# EAGLE board xio2 (EAGLE 9.2.2), part 1 of 5
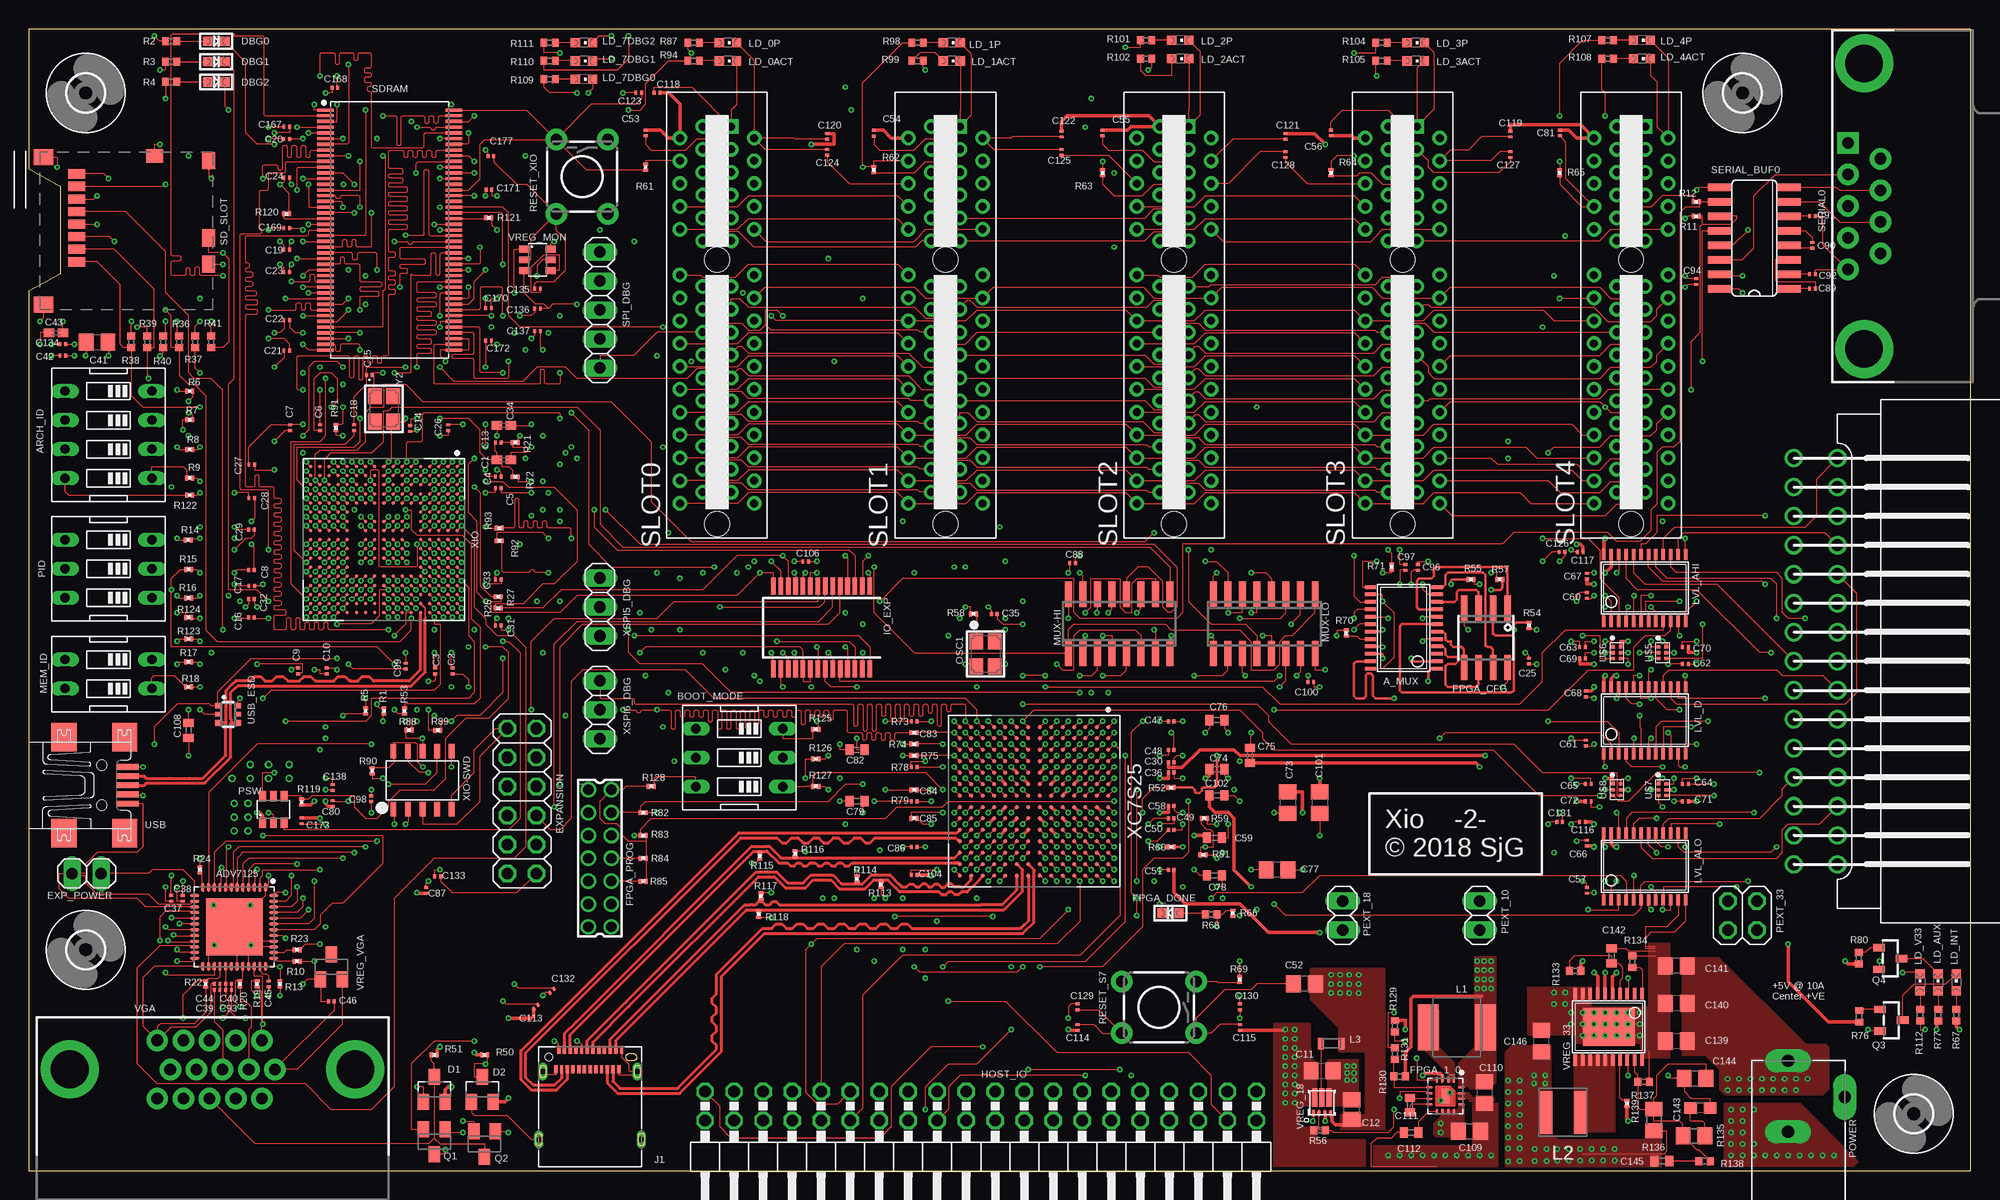
[diagram p19: board, top side]
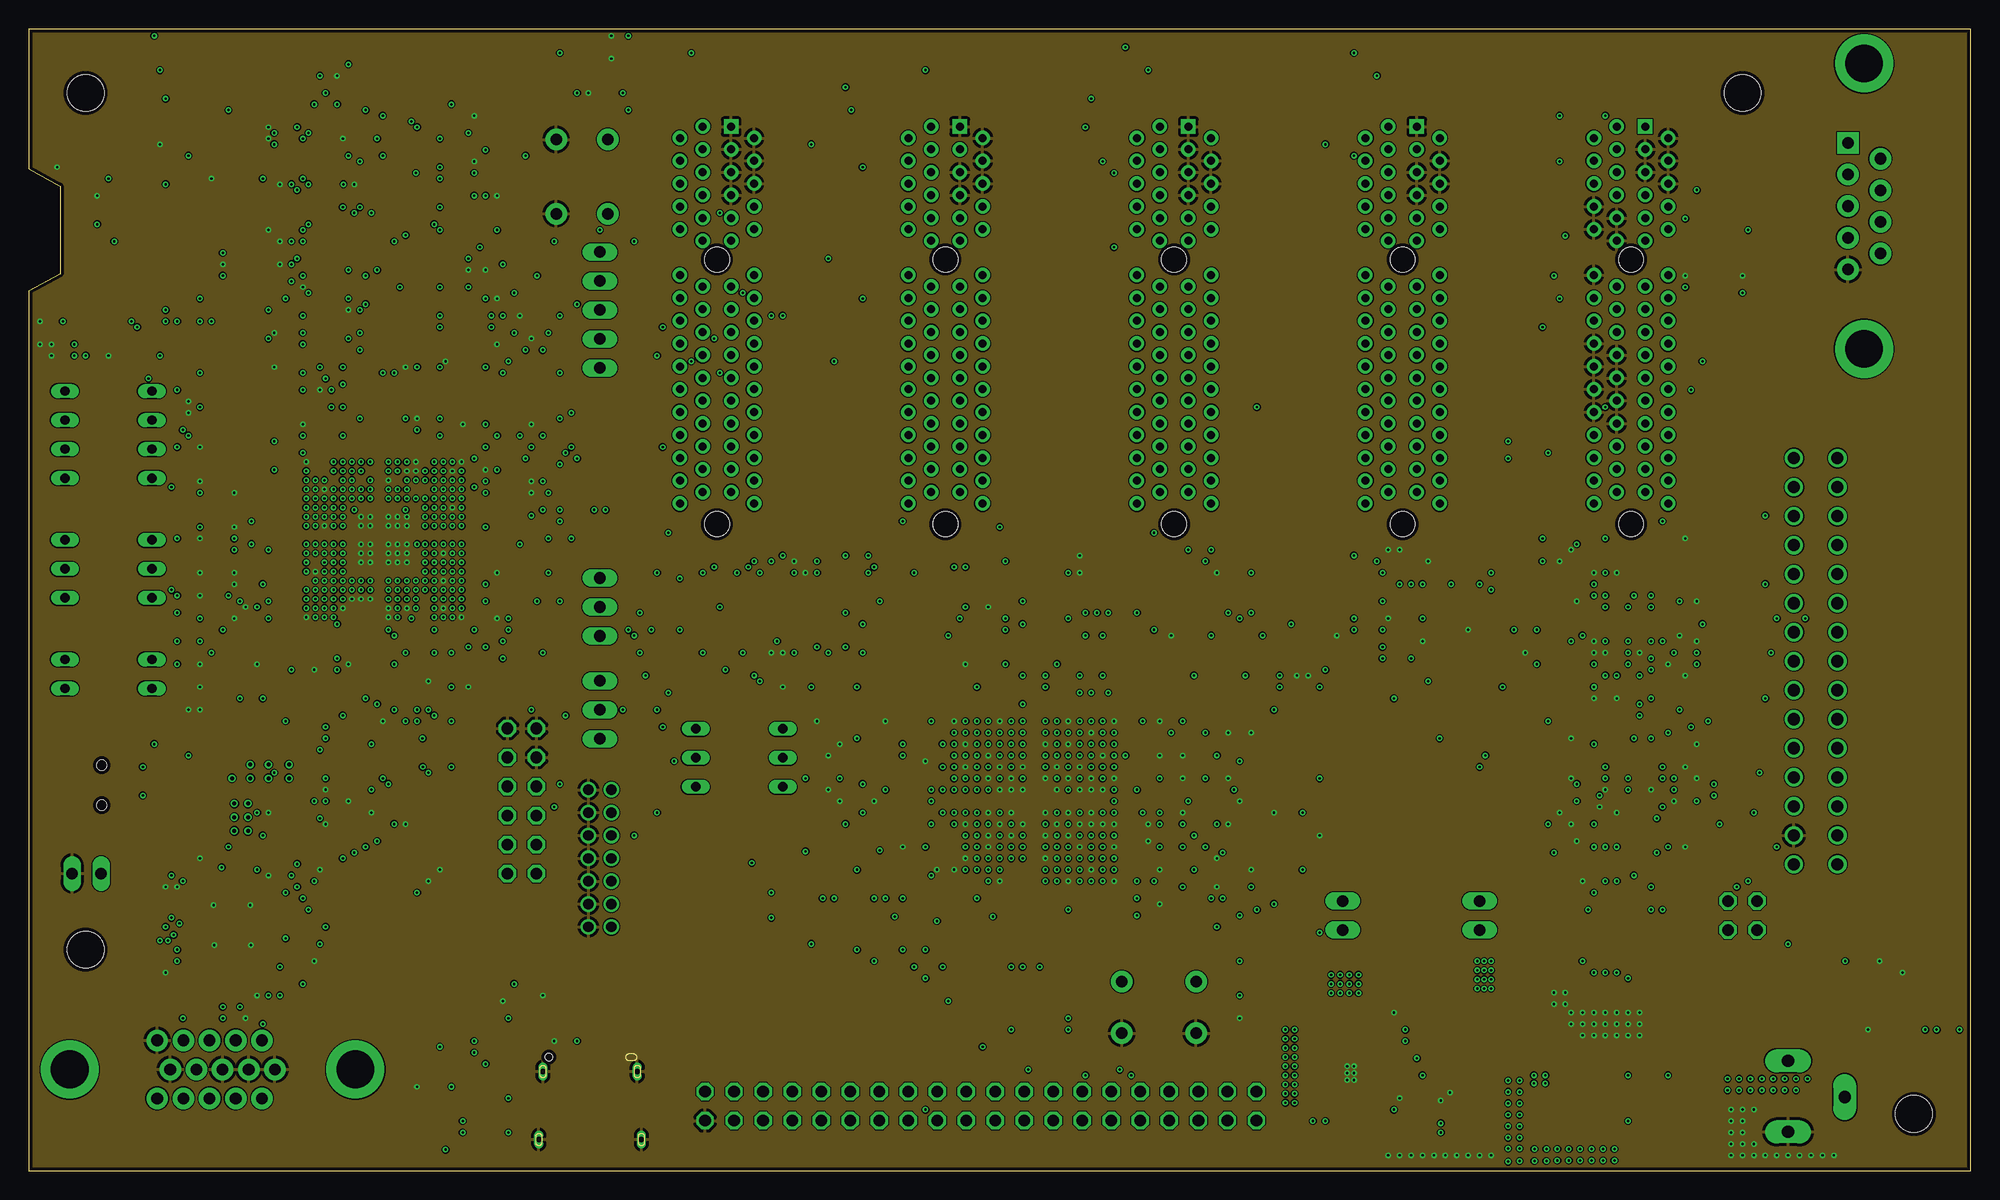
[diagram p20: board, inner layer Route2]
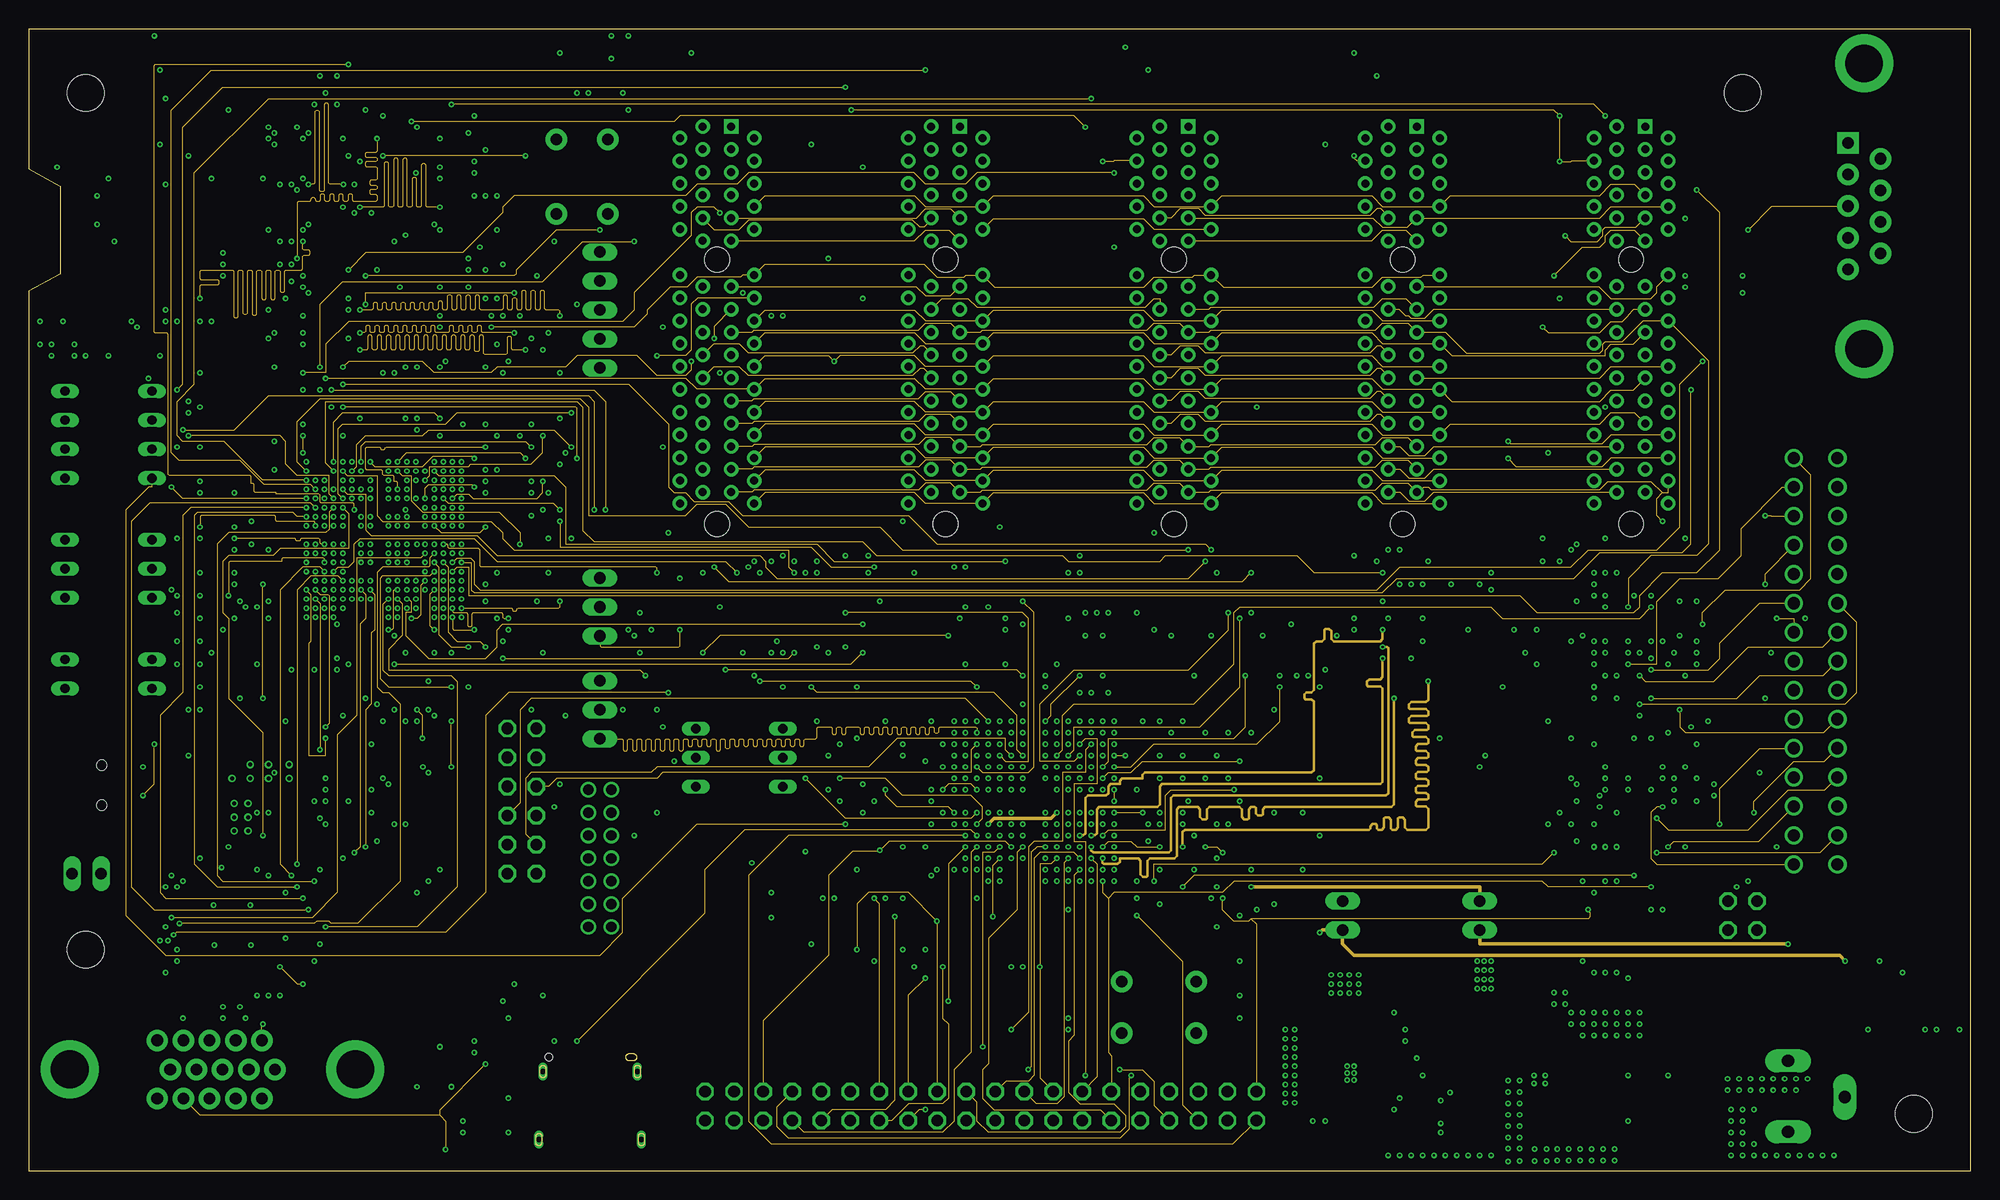
[diagram p21: board, inner layer Route3]
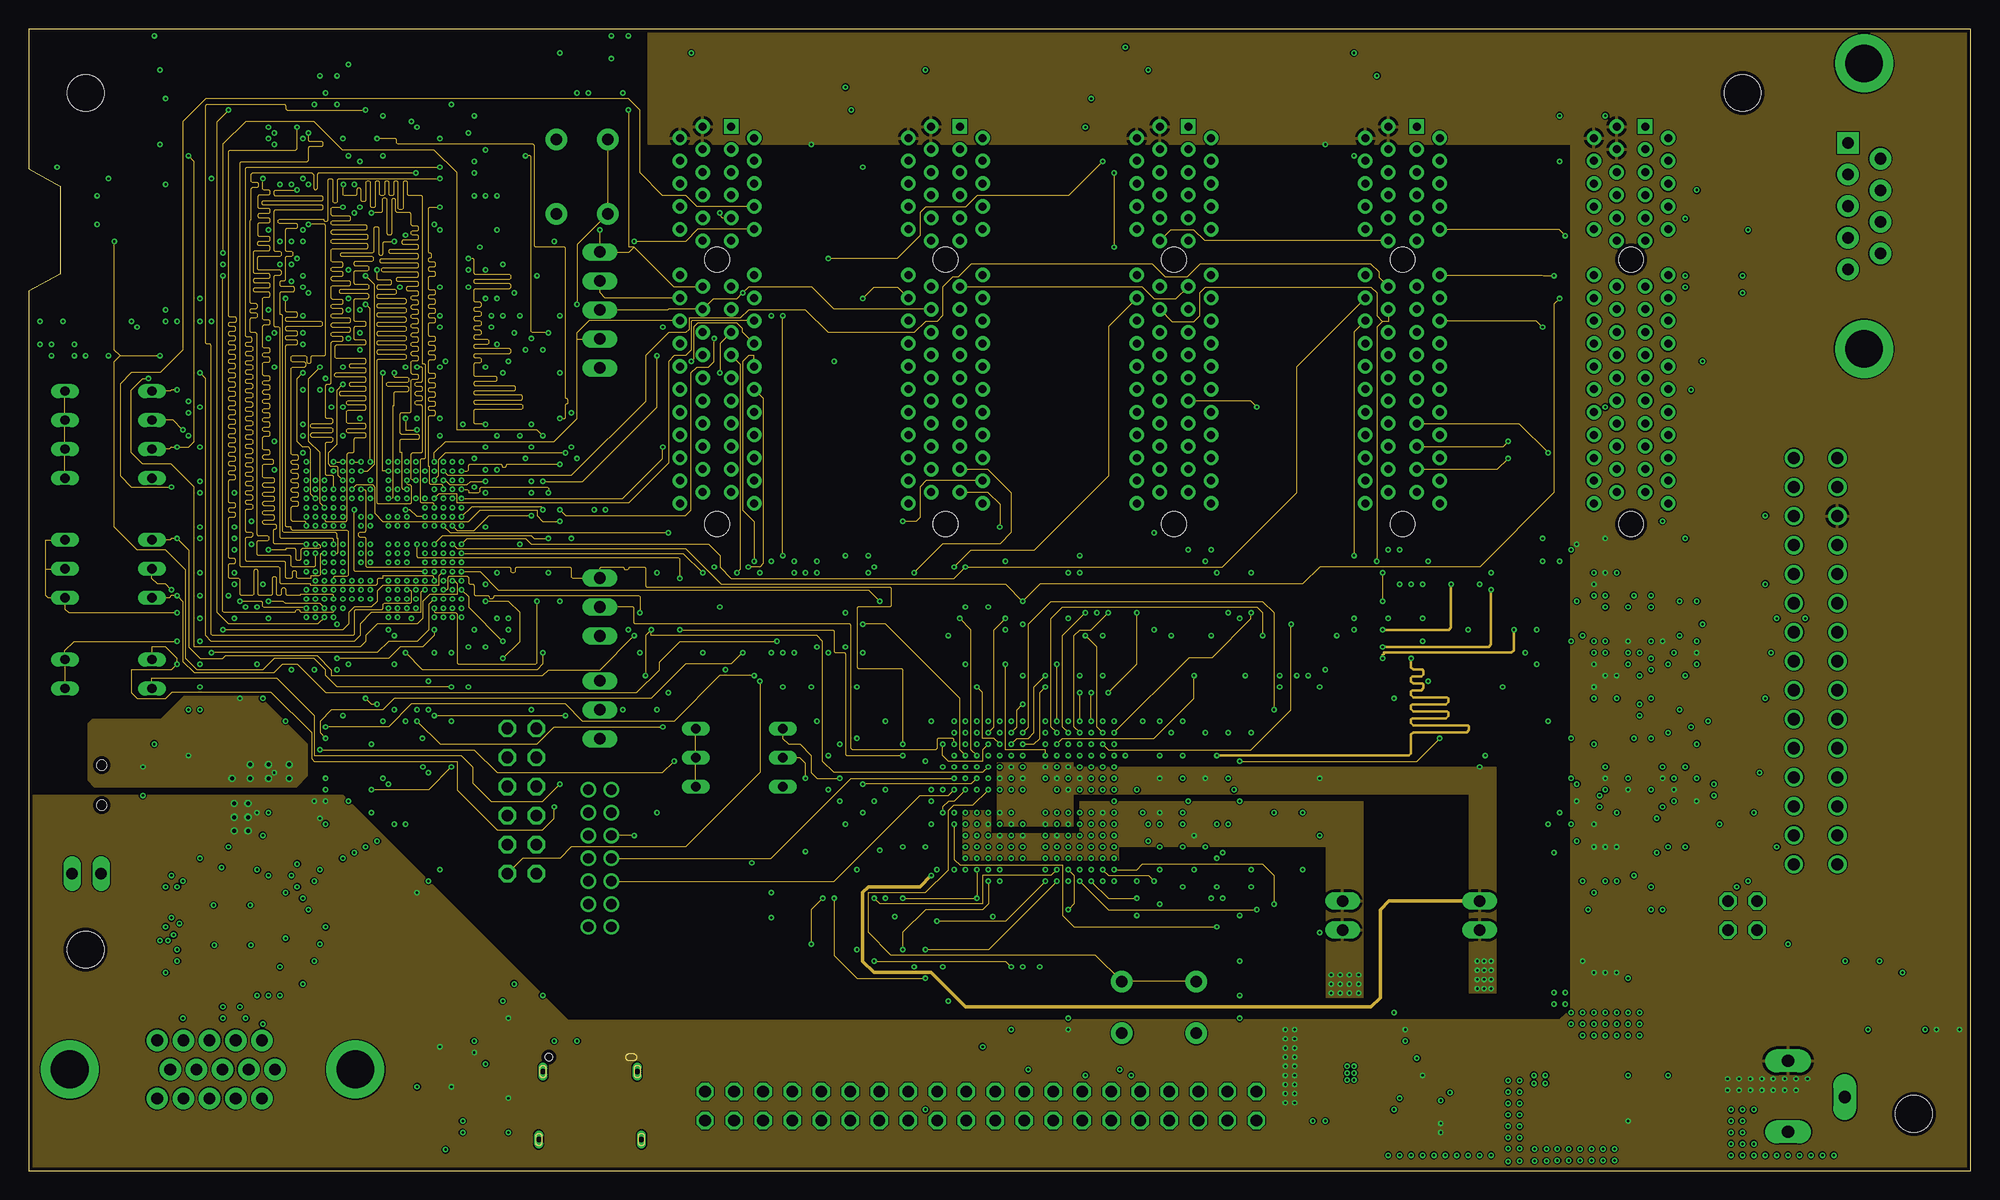
[diagram p22: board, inner layer Route14]
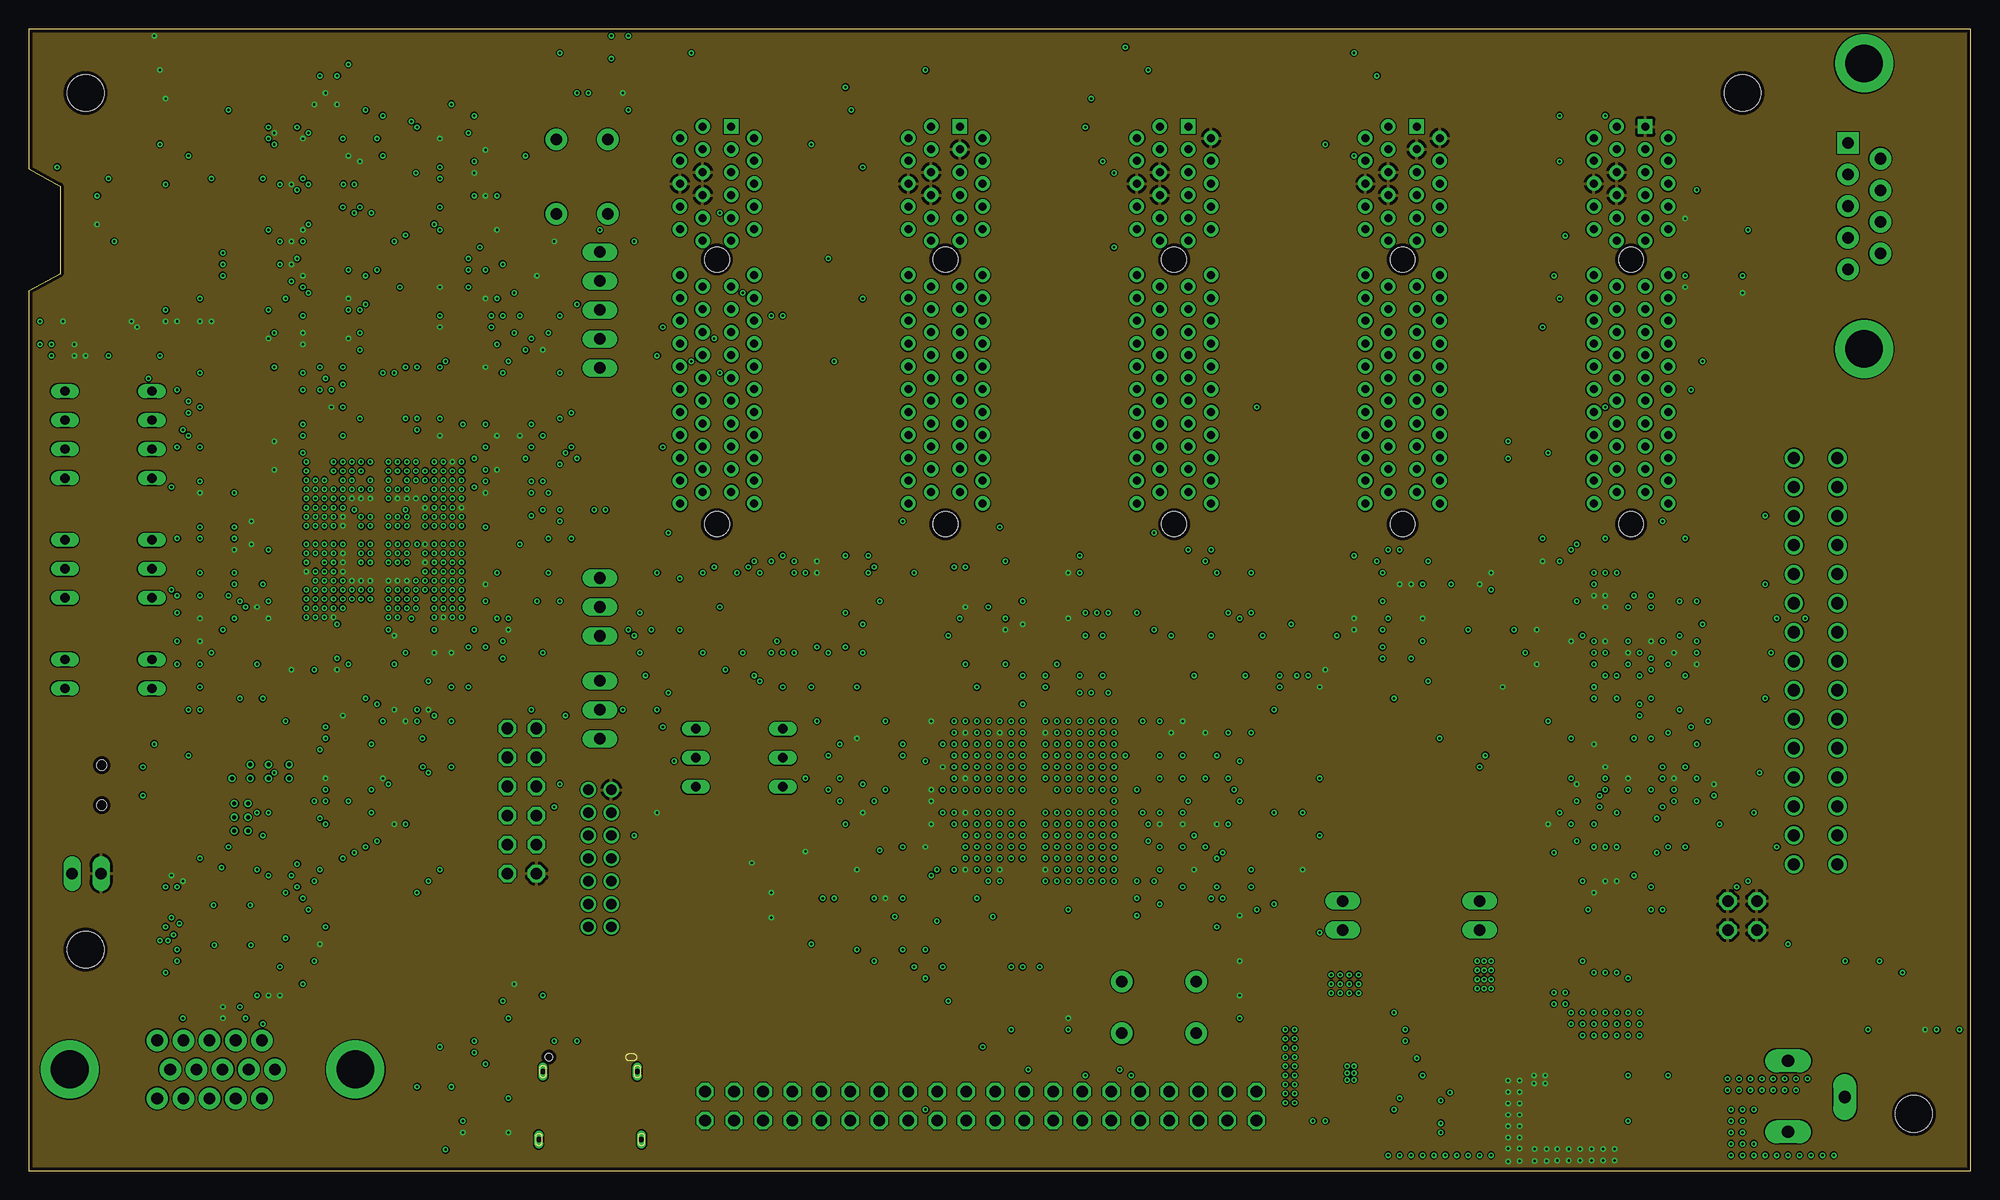
[diagram p23: board, inner layer Route15]
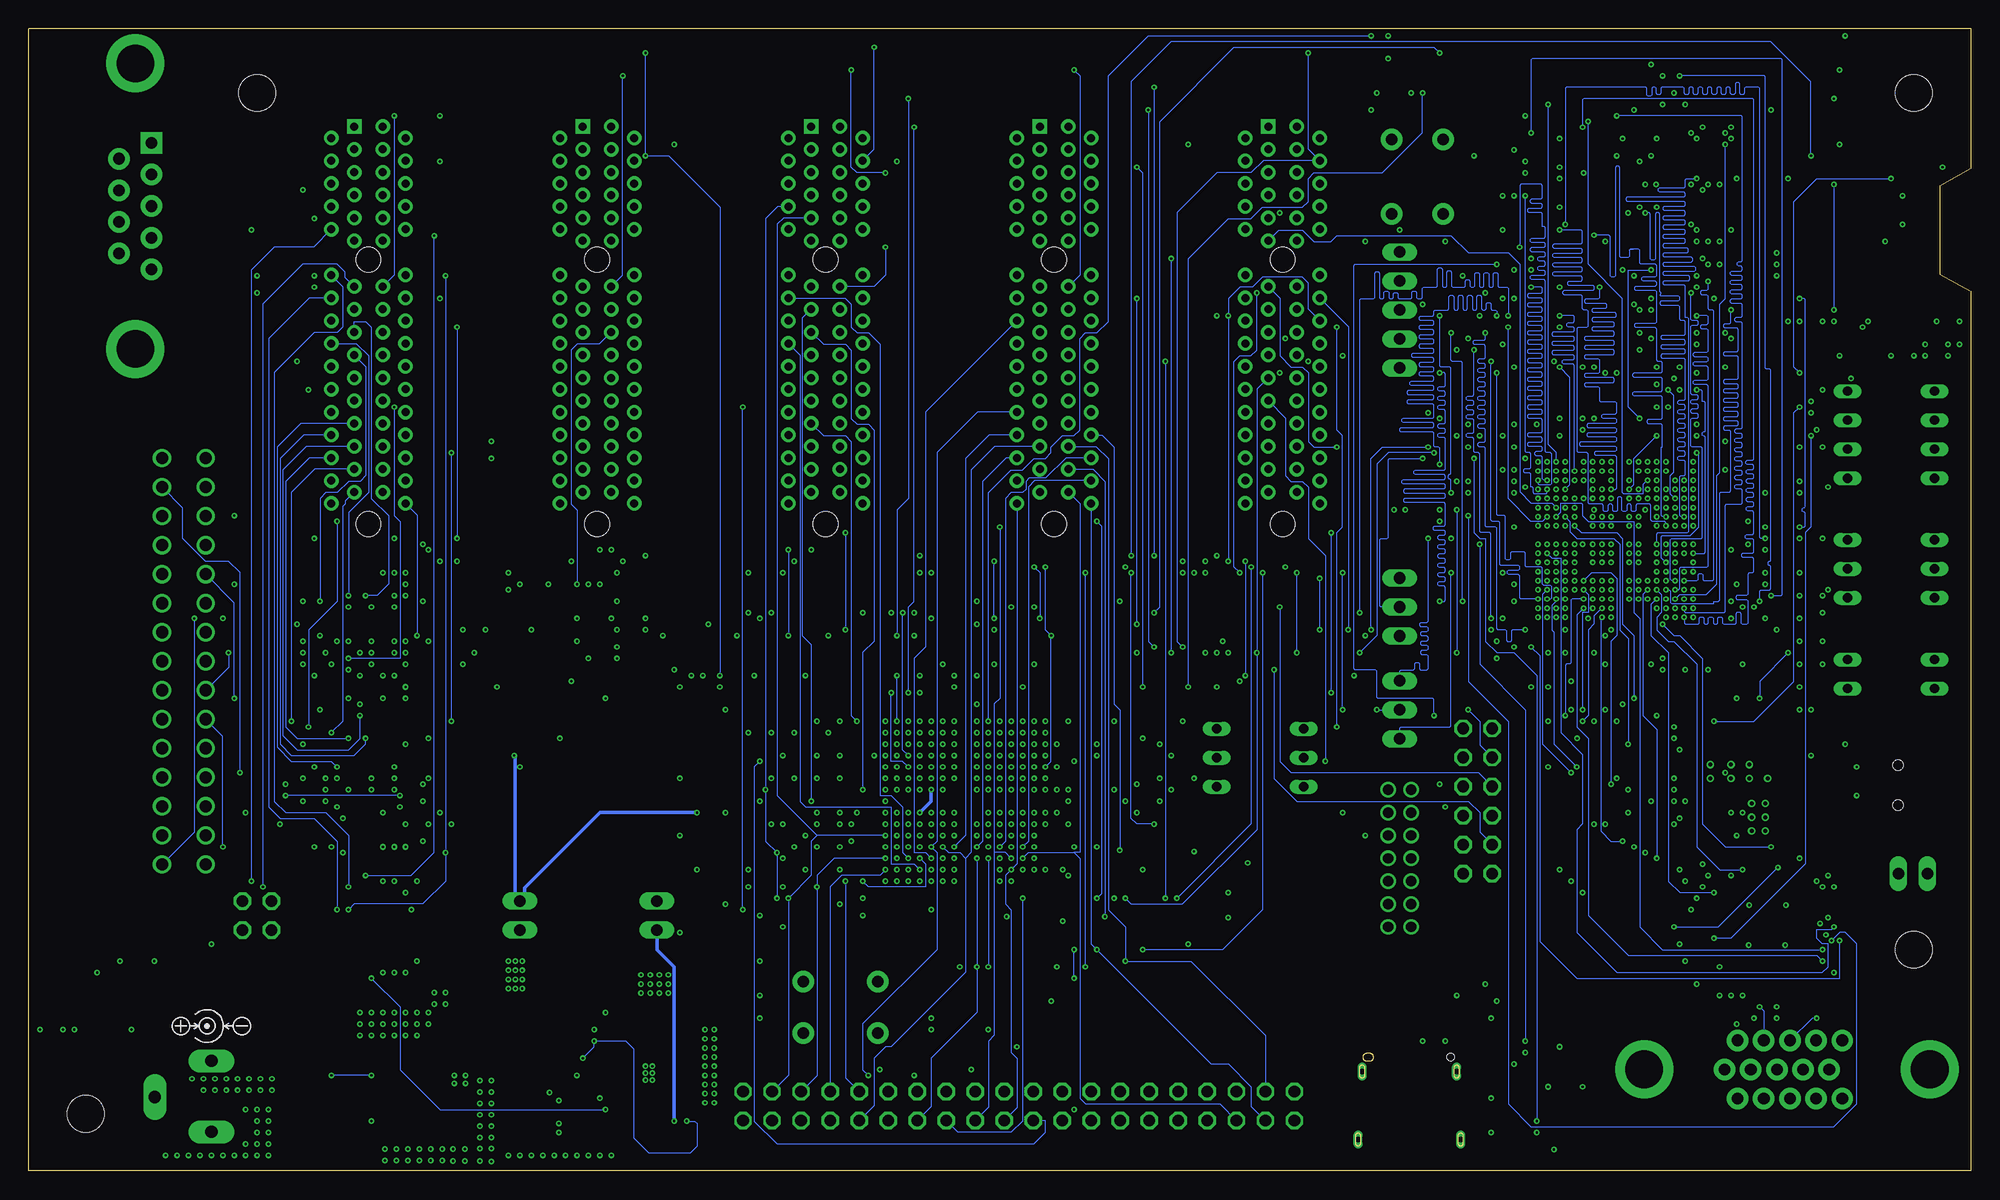
[diagram p24: board, bottom side, seen from below]

Size 170 x 100 mm. Coordinates in mm from the lower left corner, seen from the top.
Outline: 170,0 170,100 23.5,100 23,100 15,100 14,100 13,100 0,100 0,87.71 2.75,86.21 2.75,78.52 0,77.02 0,0 123.89,0 153.03,0 170,0
Copper layers (1+2*3+14*15+16): Top 0.035mm / dielectric 0.12mm / Route2 0.017mm / dielectric 0.5mm / Route3 0.017mm / dielectric 0.24mm / Route14 0.017mm / dielectric 0.5mm / Route15 0.017mm / dielectric 0.12mm / Bottom 0.035mm
Design rules "seed-6layer-4.4": minimum track width 4mil, minimum drill 0.2mm, track to track 4mil, track to pad 4mil, pad to pad 4mil, via to via 4mil, smd to smd 0mil, copper to edge 12mil, drill to drill 12mil, minimum pad ring 6mil, minimum via ring 5.5mil, stop-mask expansion 4mil, vias tented up to drill 25mil, thermal gap 10mil
Net classes: 1 Power: width 0.305 mm, drill 0.203 mm; 2 Slot-power: width 0.508 mm; 3 tx100: width 0.254 mm, clearance 0.457 mm; 4 usb90: width 0.254 mm, clearance 0.178 mm; 5 cclk50: width 0.203 mm; 6 3v3: width 0.254 mm; 7 vccint_aux: width 0.305 mm; 14 qspi: width 0.203 mm

## Footprints (pad centres in the part's own frame; a part is rotated, then mirrored left to right if it is on the bottom)
TSSOP24 = smd 0.305 x 0.991: 1 -3.575,-2.918; 2 -2.925,-2.918; 3 -2.275,-2.918; 4 -1.625,-2.918; 5 -0.975,-2.918; 6 -0.325,-2.918; 7 0.325,-2.918; 8 0.975,-2.918; 9 1.625,-2.918; 10 2.275,-2.918; 11 2.925,-2.918; 12 3.575,-2.918; 13 3.575,2.918; 14 2.925,2.918; 15 2.275,2.918; 16 1.625,2.918; 17 0.975,2.918; 18 0.325,2.918; 19 -0.325,2.918; 20 -0.975,2.918; 21 -1.625,2.918; 22 -2.275,2.918; 23 -2.925,2.918; 24 -3.575,2.918
QFN50P700X700X100-49T495 = smd 0.812 x 0.262: 1 -3.45,2.75; 2 -3.45,2.25; 3 -3.45,1.75; 4 -3.45,1.25; 5 -3.45,0.75; 6 -3.45,0.25; 7 -3.45,-0.25; 8 -3.45,-0.75; 9 -3.45,-1.25; 10 -3.45,-1.75; 11 -3.45,-2.25; 12 -3.45,-2.75; 25 3.45,-2.75; 26 3.45,-2.25; 27 3.45,-1.75; 28 3.45,-1.25; 29 3.45,-0.75; 30 3.45,-0.25; 31 3.45,0.25; 32 3.45,0.75; 33 3.45,1.25; 34 3.45,1.75; 35 3.45,2.25; 36 3.45,2.75 | smd 0.262 x 0.812: 13 -2.75,-3.45; 14 -2.25,-3.45; 15 -1.75,-3.45; 16 -1.25,-3.45; 17 -0.75,-3.45; 18 -0.25,-3.45; 19 0.25,-3.45; 20 0.75,-3.45; 21 1.25,-3.45; 22 1.75,-3.45; 23 2.25,-3.45; 24 2.75,-3.45; 37 2.75,3.45; 38 2.25,3.45; 39 1.75,3.45; 40 1.25,3.45; 41 0.75,3.45; 42 0.25,3.45; 43 -0.25,3.45; 44 -0.75,3.45; 45 -1.25,3.45; 46 -1.75,3.45; 47 -2.25,3.45; 48 -2.75,3.45 | smd 4.95 x 4.95: 49 0,0
EDG-04 = drill 0.813 long: 1 -3.81,-3.81; 2 -1.27,-3.81; 3 1.27,-3.81; 4 3.81,-3.81; 5 3.81,3.81; 6 1.27,3.81; 7 -1.27,3.81; 8 -3.81,3.81
EDG-03 = drill 0.813 long: 1 -2.54,-3.81; 2 0,-3.81; 3 2.54,-3.81; 4 2.54,3.81; 5 0,3.81; 6 -2.54,3.81
C0402K = smd 0.925 x 0.74: 1 -0.6,0; 2 0.6,0
C0201 = smd 0.25 x 0.35: 1 -0.25,0; 2 0.25,0
C0805 = smd 1.3 x 1.5: 1 -0.95,0; 2 0.95,0
C2012 = smd 1.3 x 1.5: 1 -0.85,0; 2 0.85,0
C0402 = smd 0.7 x 0.9: 1 -0.65,0; 2 0.65,0
C0603 = smd 1.1 x 1: 1 -0.85,0; 2 0.85,0
A8_CART = drill 1.067: P1 -17.78,6.35; P2 -15.24,6.35; P3 -12.7,6.35; P4 -10.16,6.35; P5 -7.62,6.35; P6 -5.08,6.35; P7 -2.54,6.35; P8 0,6.35; P9 2.54,6.35; P10 5.08,6.35; P11 7.62,6.35; P12 10.16,6.35; P13 12.7,6.35; P14 15.24,6.35; P15 17.78,6.35; PA -17.78,10.16; PB -15.24,10.16; PC -12.7,10.16; PD -10.16,10.16; PE -7.62,10.16; PF -5.08,10.16; PH -2.54,10.16; PJ 0,10.16; PK 2.54,10.16; PL 5.08,10.16; PM 7.62,10.16; PN 10.16,10.16; PP 12.7,10.16; PR 15.24,10.16; PS 17.78,10.16
SOT23 = smd 1 x 1.4: 1 -0.95,-1.1; 2 0.95,-1.1; 3 0,1.1
CHIPLED_0603 = smd 0.8 x 0.8: A 0,-0.75; C 0,0.75
1X02 = drill 1.016 long: 1 -1.27,0; 2 1.27,0
2X06 = drill 1.016 octagon: 1 -6.35,-1.27; 2 -6.35,1.27; 3 -3.81,-1.27; 4 -3.81,1.27; 5 -1.27,-1.27; 6 -1.27,1.27; 7 1.27,-1.27; 8 1.27,1.27; 9 3.81,-1.27; 10 3.81,1.27; 11 6.35,-1.27; 12 6.35,1.27
QFN50P310X310X100-16 = smd 0.6 x 0.24: 1 -1.4,0.75; 2 -1.4,0.25; 3 -1.4,-0.25; 4 -1.4,-0.75; 9 1.4,-0.75; 10 1.4,-0.25; 11 1.4,0.25; 12 1.4,0.75 | smd 0.24 x 0.6: 5 -0.75,-1.4; 6 -0.25,-1.4; 7 0.25,-1.4; 8 0.75,-1.4; 13 0.75,1.4; 14 0.25,1.4; 15 -0.25,1.4; 16 -0.75,1.4 | smd 1.27 x 0.635: PAD 0,0
SOIC8_150MIL = smd 0.6 x 2.2: 1 -1.905,-2.6; 2 -0.635,-2.6; 3 0.635,-2.6; 4 1.905,-2.6; 5 1.905,2.6; 6 0.635,2.6; 7 -0.635,2.6; 8 -1.905,2.6
332-14 = drill 0.9 pad 1.27: 1 -6,-1; 2 -6,1; 3 -4,-1; 4 -4,1; 5 -2,-1; 6 -2,1; 7 0,-1; 8 0,1; 9 2,-1; 10 2,1; 11 4,-1; 12 4,1; 13 6,-1; 14 6,1
3,2 = hole 3.2: 0,0
2X20/90 = drill 1.016 octagon: 1 -24.13,-6.35; 2 -24.13,-3.81; 3 -21.59,-6.35; 4 -21.59,-3.81; 5 -19.05,-6.35; 6 -19.05,-3.81; 7 -16.51,-6.35; 8 -16.51,-3.81; 9 -13.97,-6.35; 10 -13.97,-3.81; 11 -11.43,-6.35; 12 -11.43,-3.81; 13 -8.89,-6.35; 14 -8.89,-3.81; 15 -6.35,-6.35; 16 -6.35,-3.81; 17 -3.81,-6.35; 18 -3.81,-3.81; 19 -1.27,-6.35; 20 -1.27,-3.81; 21 1.27,-6.35; 22 1.27,-3.81; 23 3.81,-6.35; 24 3.81,-3.81; 25 6.35,-6.35; 26 6.35,-3.81; 27 8.89,-6.35; 28 8.89,-3.81; 29 11.43,-6.35; 30 11.43,-3.81; 31 13.97,-6.35; 32 13.97,-3.81; 33 16.51,-6.35; 34 16.51,-3.81; 35 19.05,-6.35; 36 19.05,-3.81; 37 21.59,-6.35; 38 21.59,-3.81; 39 24.13,-6.35; 40 24.13,-3.81
SSOP28 = smd 0.4 x 1.5: 1 -4.225,-3.625; 2 -3.575,-3.625; 3 -2.925,-3.625; 4 -2.275,-3.625; 5 -1.625,-3.625; 6 -0.975,-3.625; 7 -0.325,-3.625; 8 0.325,-3.625; 9 0.975,-3.625; 10 1.625,-3.625; 11 2.275,-3.625; 12 2.925,-3.625; 13 3.575,-3.625; 14 4.225,-3.625; 15 4.225,3.625; 16 3.575,3.625; 17 2.925,3.625; 18 2.275,3.625; 19 1.625,3.625; 20 0.975,3.625; 21 0.325,3.625; 22 -0.325,3.625; 23 -0.975,3.625; 24 -1.625,3.625; 25 -2.275,3.625; 26 -2.925,3.625; 27 -3.575,3.625; 28 -4.225,3.625
AMPHENOL_12401598E4#2A = smd 0.3 x 0.7: A1 -2.75,0.66; A2 -2.25,0.66; A3 -1.75,0.66; A4 -1.25,0.66; A5 -0.75,0.66; A6 -0.25,0.66; A7 0.25,0.66; A8 0.75,0.66; A9 1.25,0.66; A10 1.75,0.66; A11 2.25,0.66; A12 2.75,0.66; B1 2.5,-1.04; B2 2,-1.04; B3 1.5,-1.04; B4 1,-1.04; B5 0.5,-1.04; B6 0,-1.04; B7 -0.5,-1.04; B8 -1,-1.04; B9 -1.5,-1.04; B10 -2,-1.04; B11 -2.5,-1.04; B12 -3,-1.04 | drill 0.5 pad 0.8 long: SH1 -4.13,-1.25; SH2 -4.49,-7.2; SH3 4.49,-7.2; SH4 4.13,-1.25 | hole 0.65: -3.6,0
L5650M = smd 1.8 x 4: 1 -2.5,0; 2 2.5,0
RESC4137X200 = smd 1.1 x 3.7: 1 -1.5,0; 2 1.5,0
L0603 = smd 0.55 x 1: 1 -0.9,0; 2 0.9,0
EDG-02 = drill 0.813 long: 1 -1.27,-3.81; 2 1.27,-3.81; 3 1.27,3.81; 4 -1.27,3.81
SO16 = smd 0.6 x 2.2: 1 -4.445,-2.6; 2 -3.175,-2.6; 3 -1.905,-2.6; 4 -0.635,-2.6; 5 0.635,-2.6; 6 1.905,-2.6; 7 3.175,-2.6; 8 4.445,-2.6; 9 4.445,2.6; 10 3.175,2.6; 11 1.905,2.6; 12 0.635,2.6; 13 -0.635,2.6; 14 -1.905,2.6; 15 -3.175,2.6; 16 -4.445,2.6
OSC_3.2X2.5MM = smd 1.4 x 1.2: 1 -1.1,-0.8; 2 1.1,-0.8; 3 1.1,0.8; 4 -1.1,0.8
2X02 = drill 1.016 octagon: 1 -1.27,-1.27; 2 -1.27,1.27; 3 1.27,-1.27; 4 1.27,1.27
DCJ3P-14.2X11.0X9.0MM = drill 1.067 pad 2.032 long: + 3.175,0; -1 -3.048,0; -2 0,-4.953
SOT23-6 = smd 0.6 x 0.9: 1 -0.95,-1.15; 2 0,-1.15; 3 0.95,-1.15; 4 0.95,1.15; 5 0,1.15; 6 -0.95,1.15
SOT23-R = smd 0.635 x 1.016: 1 -0.95,-1; 2 0.95,-1; 3 0,1
R0201 = smd 0.28 x 0.43: 1 -0.255,0; 2 0.255,0
R0402 = smd 0.6 x 0.7: 1 -0.5,0; 2 0.5,0
R0805 = smd 1.3 x 1.5: 1 -0.95,0; 2 0.95,0
TACTILE-PTH = drill 1.016 pad 1.88: 1 -3.251,2.261; 2 3.251,2.261; 3 -3.251,-2.261; 4 3.251,-2.261
5025700893 = smd 1.5 x 1.15: DTCT -0.6,-7.375; GND1 6.15,-7.375; GND3 -2.9,-7.375 | smd 1.4 x 1.7: GND0 6.45,7.1; GND2 -6.45,7.1 | smd 1.15 x 1.5: GND4 6.575,-2.65 | smd 0.8 x 1.5: P$1 -2.7,4.2; P$2 -1.6,4.2; P$3 -0.5,4.2; P$4 0.6,4.2; P$5 1.7,4.2; P$6 2.8,4.2; P$7 3.9,4.2; P$8 5,4.2
SOP50P1176X120-86 = smd 1.436 x 0.28: 1 -5.619,10.5; 2 -5.619,10; 3 -5.619,9.5; 4 -5.619,9; 5 -5.619,8.5; 6 -5.619,8; 7 -5.619,7.5; 8 -5.619,7; 9 -5.619,6.5; 10 -5.619,6; 11 -5.619,5.5; 12 -5.619,5; 13 -5.619,4.5; 14 -5.619,4; 15 -5.619,3.5; 16 -5.619,3; 17 -5.619,2.5; 18 -5.619,2; 19 -5.619,1.5; 20 -5.619,1; 21 -5.619,0.5; 22 -5.619,0; 23 -5.619,-0.5; 24 -5.619,-1; 25 -5.619,-1.5; 26 -5.619,-2; 27 -5.619,-2.5; 28 -5.619,-3; 29 -5.619,-3.5; 30 -5.619,-4; 31 -5.619,-4.5; 32 -5.619,-5; 33 -5.619,-5.5; 34 -5.619,-6; 35 -5.619,-6.5; 36 -5.619,-7; 37 -5.619,-7.5; 38 -5.619,-8; 39 -5.619,-8.5; 40 -5.619,-9; 41 -5.619,-9.5; 42 -5.619,-10; 43 -5.619,-10.5; 44 5.619,-10.5; 45 5.619,-10; 46 5.619,-9.5; 47 5.619,-9; 48 5.619,-8.5; 49 5.619,-8; 50 5.619,-7.5; 51 5.619,-7; 52 5.619,-6.5; 53 5.619,-6; 54 5.619,-5.5; 55 5.619,-5; 56 5.619,-4.5; 57 5.619,-4; 58 5.619,-3.5; 59 5.619,-3; 60 5.619,-2.5; 61 5.619,-2; 62 5.619,-1.5; 63 5.619,-1; 64 5.619,-0.5; 65 5.619,0; 66 5.619,0.5; 67 5.619,1; 68 5.619,1.5; 69 5.619,2; 70 5.619,2.5; 71 5.619,3; 72 5.619,3.5; 73 5.619,4; 74 5.619,4.5; 75 5.619,5; 76 5.619,5.5; 77 5.619,6; 78 5.619,6.5; 79 5.619,7; 80 5.619,7.5; 81 5.619,8; 82 5.619,8.5; 83 5.619,9; 84 5.619,9.5; 85 5.619,10; 86 5.619,10.5
DB9 = drill 1.016 pad 1.88 square: 1 -5.54,-1.42 | drill 1.016 pad 1.88: 2 -2.77,-1.42; 3 0,-1.42; 4 2.77,-1.42; 5 5.54,-1.42; 6 -4.15,1.42; 7 -1.38,1.42; 8 1.38,1.42; 9 4.15,1.42 | drill 3.302 pad 5.08: G1 -12.5,0; G2 12.5,0
SO16' = smd 0.66 x 2.032: 1 -4.445,-3.073; 2 -3.175,-3.073; 3 -1.905,-3.073; 4 -0.635,-3.073; 5 0.635,-3.073; 6 1.905,-3.073; 7 3.175,-3.073; 8 4.445,-3.073; 9 4.445,3.073; 10 3.175,3.073; 11 1.905,3.073; 12 0.635,3.073; 13 -0.635,3.073; 14 -1.905,3.073; 15 -3.175,3.073; 16 -4.445,3.073
PCI-E_64 = drill 0.7 pad 1.27 square: A1 -12.06,1.5 | drill 0.7 pad 1.27: A2 -11.06,3.5; A3 -10.06,1.5; A4 -9.06,3.5; A5 -8.06,1.5; A6 -7.06,3.5; A7 -6.06,1.5; A8 -5.06,3.5; A9 -4.06,1.5; A10 -3.06,3.5; A11 -2.06,1.5; A12 0.94,3.5; A13 1.94,1.5; A14 2.94,3.5; A15 3.94,1.5; A16 4.94,3.5; A17 5.94,1.5; A18 6.94,3.5; A19 7.94,1.5; A20 8.94,3.5; A21 9.94,1.5; A22 10.94,3.5; A23 11.94,1.5; A24 12.94,3.5; A25 13.94,1.5; A26 14.94,3.5; A27 15.94,1.5; A28 16.94,3.5; A29 17.94,1.5; A30 18.94,3.5; A31 19.94,1.5; A32 20.94,3.5; B1 -12.06,-1; B2 -11.06,-3; B3 -10.06,-1; B4 -9.06,-3; B5 -8.06,-1; B6 -7.06,-3; B7 -6.06,-1; B8 -5.06,-3; B9 -4.06,-1; B10 -3.06,-3; B11 -2.06,-1; B12 0.94,-3; B13 1.94,-1; B14 2.94,-3; B15 3.94,-1; B16 4.94,-3; B17 5.94,-1; B18 6.94,-3; B19 7.94,-1; B20 8.94,-3; B21 9.94,-1; B22 10.94,-3; B23 11.94,-1; B24 12.94,-3; B25 13.94,-1; B26 14.94,-3; B27 15.94,-1; B28 16.94,-3; B29 17.94,-1; B30 18.94,-3; B31 19.94,-1; B32 20.94,-3 | hole 2.15: -0.41,0.25; 22.74,0.25
1X05 = drill 1.016 long: 1 -5.08,0; 2 -2.54,0; 3 0,0; 4 2.54,0; 5 5.08,0
SOT886 = smd 0.325 x 0.27: 1 -0.338,0.5; 2 -0.338,0; 3 -0.338,-0.5; 4 0.338,-0.5; 5 0.338,0; 6 0.338,0.5
UX60-MB-5ST = smd 2 x 0.5: 1 2.25,1.6; 2 2.25,0.8; 3 2.25,0; 4 2.25,-0.8; 5 2.25,-1.6 | smd 2.2 x 2.5: M1 -3.3,-4.2; M2 -3.3,4.2; M3 2,4.2; M4 2,-4.2 | hole 0.9: 0,-1.75; 0,1.75
SOT363 = smd 0.5 x 0.5: 1 -0.75,-0.9; 3 0.75,-0.9; 4 0.75,0.9; 6 -0.75,0.9 | smd 0.4 x 0.5: 2 0,-0.9; 5 0,0.9
DB15 = drill 1.016 pad 1.88: 1 -4.32,-7.62; 2 -2.03,-7.62; 3 0.26,-7.62; 4 2.55,-7.62; 5 4.84,-7.62; 6 -5.46,-5.08; 7 -3.17,-5.08; 8 -0.88,-5.08; 9 1.41,-5.08; 10 3.7,-5.08; 11 -4.32,-2.54; 12 -2.03,-2.54; 13 0.26,-2.54; 14 2.55,-2.54; 15 4.84,-2.54 | drill 3.302 pad 5.08: G1 -12.5,-5.08; G2 12.5,-5.08
RLT0007A = smd 0.6 x 0.25: 1 -0.9,0.75; 2 -0.9,0.25; 3 -0.9,-0.25; 4 -0.9,-0.75 | smd 1.64 x 0.44: 5 0.45,-0.6; 6 0.45,0; 7 0.45,0.6
HTSSOP20 = smd 0.305 x 0.991: 1 -2.925,-2.918; 2 -2.275,-2.918; 3 -1.625,-2.918; 4 -0.975,-2.918; 5 -0.325,-2.918; 6 0.325,-2.918; 7 0.975,-2.918; 8 1.625,-2.918; 9 2.275,-2.918; 10 2.925,-2.918; 11 2.925,2.918; 12 2.275,2.918; 13 1.625,2.918; 14 0.975,2.918; 15 0.325,2.918; 16 -0.325,2.918; 17 -0.975,2.918; 18 -1.625,2.918; 19 -2.275,2.918; 20 -2.925,2.918 | smd 4.55 x 3.32: TAB 0,0
BGA196C100P14X14_1500X1500X146 = smd 0.35 x 0.35: A1 -6.5,6.5; A2 -5.5,6.5; A3 -4.5,6.5; A4 -3.5,6.5; A5 -2.5,6.5; A6 -1.5,6.5; A7 -0.5,6.5; A8 0.5,6.5; A9 1.5,6.5; A10 2.5,6.5; A11 3.5,6.5; A12 4.5,6.5; A13 5.5,6.5; A14 6.5,6.5; B1 -6.5,5.5; B2 -5.5,5.5; B3 -4.5,5.5; B4 -3.5,5.5; B5 -2.5,5.5; B6 -1.5,5.5; B7 -0.5,5.5; B8 0.5,5.5; B9 1.5,5.5; B10 2.5,5.5; B11 3.5,5.5; B12 4.5,5.5; B13 5.5,5.5; B14 6.5,5.5; C1 -6.5,4.5; C2 -5.5,4.5; C3 -4.5,4.5; C4 -3.5,4.5; C5 -2.5,4.5; C6 -1.5,4.5; C7 -0.5,4.5; C8 0.5,4.5; C9 1.5,4.5; C10 2.5,4.5; C11 3.5,4.5; C12 4.5,4.5; C13 5.5,4.5; C14 6.5,4.5; D1 -6.5,3.5; D2 -5.5,3.5; D3 -4.5,3.5; D4 -3.5,3.5; D5 -2.5,3.5; D6 -1.5,3.5; D7 -0.5,3.5; D8 0.5,3.5; D9 1.5,3.5; D10 2.5,3.5; D11 3.5,3.5; D12 4.5,3.5; D13 5.5,3.5; D14 6.5,3.5; E1 -6.5,2.5; E2 -5.5,2.5; E3 -4.5,2.5; E4 -3.5,2.5; E5 -2.5,2.5; E6 -1.5,2.5; E7 -0.5,2.5; E8 0.5,2.5; E9 1.5,2.5; E10 2.5,2.5; E11 3.5,2.5; E12 4.5,2.5; E13 5.5,2.5; E14 6.5,2.5; F1 -6.5,1.5; F2 -5.5,1.5; F3 -4.5,1.5; F4 -3.5,1.5; F5 -2.5,1.5; F6 -1.5,1.5; F7 -0.5,1.5; F8 0.5,1.5; F9 1.5,1.5; F10 2.5,1.5; F11 3.5,1.5; F12 4.5,1.5; F13 5.5,1.5; F14 6.5,1.5; G1 -6.5,0.5; G2 -5.5,0.5; G3 -4.5,0.5; G4 -3.5,0.5; G5 -2.5,0.5; G6 -1.5,0.5; G7 -0.5,0.5; G8 0.5,0.5; G9 1.5,0.5; G10 2.5,0.5; G11 3.5,0.5; G12 4.5,0.5; G13 5.5,0.5; G14 6.5,0.5; H1 -6.5,-0.5; H2 -5.5,-0.5; H3 -4.5,-0.5; H4 -3.5,-0.5; H5 -2.5,-0.5; H6 -1.5,-0.5; H7 -0.5,-0.5; H8 0.5,-0.5; H9 1.5,-0.5; H10 2.5,-0.5; H11 3.5,-0.5; H12 4.5,-0.5; H13 5.5,-0.5; H14 6.5,-0.5; J1 -6.5,-1.5; J2 -5.5,-1.5; J3 -4.5,-1.5; J4 -3.5,-1.5; J5 -2.5,-1.5; J6 -1.5,-1.5; J7 -0.5,-1.5; J8 0.5,-1.5; J9 1.5,-1.5; J10 2.5,-1.5; J11 3.5,-1.5; J12 4.5,-1.5; J13 5.5,-1.5; J14 6.5,-1.5; K1 -6.5,-2.5; K2 -5.5,-2.5; K3 -4.5,-2.5; K4 -3.5,-2.5; K5 -2.5,-2.5; K6 -1.5,-2.5; K7 -0.5,-2.5; K8 0.5,-2.5; K9 1.5,-2.5; K10 2.5,-2.5; K11 3.5,-2.5; K12 4.5,-2.5; K13 5.5,-2.5; K14 6.5,-2.5; L1 -6.5,-3.5; L2 -5.5,-3.5; L3 -4.5,-3.5; L4 -3.5,-3.5; L5 -2.5,-3.5; L6 -1.5,-3.5; L7 -0.5,-3.5; L8 0.5,-3.5; L9 1.5,-3.5; L10 2.5,-3.5; L11 3.5,-3.5; L12 4.5,-3.5; L13 5.5,-3.5; L14 6.5,-3.5; M1 -6.5,-4.5; M2 -5.5,-4.5; M3 -4.5,-4.5; M4 -3.5,-4.5; M5 -2.5,-4.5; M6 -1.5,-4.5; M7 -0.5,-4.5; M8 0.5,-4.5; M9 1.5,-4.5; M10 2.5,-4.5; M11 3.5,-4.5; M12 4.5,-4.5; M13 5.5,-4.5; M14 6.5,-4.5; N1 -6.5,-5.5; N2 -5.5,-5.5; N3 -4.5,-5.5; N4 -3.5,-5.5; N5 -2.5,-5.5; N6 -1.5,-5.5; N7 -0.5,-5.5; N8 0.5,-5.5; N9 1.5,-5.5; N10 2.5,-5.5; N11 3.5,-5.5; N12 4.5,-5.5; N13 5.5,-5.5; N14 6.5,-5.5; P1 -6.5,-6.5; P2 -5.5,-6.5; P3 -4.5,-6.5; P4 -3.5,-6.5; P5 -2.5,-6.5; P6 -1.5,-6.5; P7 -0.5,-6.5; P8 0.5,-6.5; P9 1.5,-6.5; P10 2.5,-6.5; P11 3.5,-6.5; P12 4.5,-6.5; P13 5.5,-6.5; P14 6.5,-6.5
BGA289C80P17X17_1400X1400X110 = smd 0.29 x 0.29: A1 -6.4,6.4; A2 -5.6,6.4; A3 -4.8,6.4; A4 -4,6.4; A5 -3.2,6.4; A6 -2.4,6.4; A7 -1.6,6.4; A8 -0.8,6.4; A9 0,6.4; A10 0.8,6.4; A11 1.6,6.4; A12 2.4,6.4; A13 3.2,6.4; A14 4,6.4; A15 4.8,6.4; A16 5.6,6.4; A17 6.4,6.4; B1 -6.4,5.6; B2 -5.6,5.6; B3 -4.8,5.6; B4 -4,5.6; B5 -3.2,5.6; B6 -2.4,5.6; B7 -1.6,5.6; B8 -0.8,5.6; B9 0,5.6; B10 0.8,5.6; B11 1.6,5.6; B12 2.4,5.6; B13 3.2,5.6; B14 4,5.6; B15 4.8,5.6; B16 5.6,5.6; B17 6.4,5.6; C1 -6.4,4.8; C2 -5.6,4.8; C3 -4.8,4.8; C4 -4,4.8; C5 -3.2,4.8; C6 -2.4,4.8; C7 -1.6,4.8; C8 -0.8,4.8; C9 0,4.8; C10 0.8,4.8; C11 1.6,4.8; C12 2.4,4.8; C13 3.2,4.8; C14 4,4.8; C15 4.8,4.8; C16 5.6,4.8; C17 6.4,4.8; D1 -6.4,4; D2 -5.6,4; D3 -4.8,4; D4 -4,4; D5 -3.2,4; D6 -2.4,4; D7 -1.6,4; D8 -0.8,4; D9 0,4; D10 0.8,4; D11 1.6,4; D12 2.4,4; D13 3.2,4; D14 4,4; D15 4.8,4; D16 5.6,4; D17 6.4,4; E1 -6.4,3.2; E2 -5.6,3.2; E3 -4.8,3.2; E4 -4,3.2; E5 -3.2,3.2; E6 -2.4,3.2; E7 -1.6,3.2; E8 -0.8,3.2; E9 0,3.2; E10 0.8,3.2; E11 1.6,3.2; E12 2.4,3.2; E13 3.2,3.2; E14 4,3.2; E15 4.8,3.2; E16 5.6,3.2; E17 6.4,3.2; F1 -6.4,2.4; F2 -5.6,2.4; F3 -4.8,2.4; F4 -4,2.4; F5 -3.2,2.4; F13 3.2,2.4; F14 4,2.4; F15 4.8,2.4; F16 5.6,2.4; F17 6.4,2.4; G1 -6.4,1.6; G2 -5.6,1.6; G3 -4.8,1.6; G4 -4,1.6; G5 -3.2,1.6; G7 -1.6,1.6; G8 -0.8,1.6; G9 0,1.6; G10 0.8,1.6; G11 1.6,1.6; G13 3.2,1.6; G14 4,1.6; G15 4.8,1.6; G16 5.6,1.6; G17 6.4,1.6; H1 -6.4,0.8; H2 -5.6,0.8; H3 -4.8,0.8; H4 -4,0.8; H5 -3.2,0.8; H7 -1.6,0.8; H8 -0.8,0.8; H9 0,0.8; H10 0.8,0.8; H11 1.6,0.8; H13 3.2,0.8; H14 4,0.8; H15 4.8,0.8; H16 5.6,0.8; H17 6.4,0.8; J1 -6.4,0; J2 -5.6,0; J3 -4.8,0; J4 -4,0; J5 -3.2,0; J7 -1.6,0; J8 -0.8,0; J9 0,0; J10 0.8,0; J11 1.6,0; J13 3.2,0; J14 4,0; J15 4.8,0; J16 5.6,0; J17 6.4,0; K1 -6.4,-0.8; K2 -5.6,-0.8; K3 -4.8,-0.8; K4 -4,-0.8; K5 -3.2,-0.8; K7 -1.6,-0.8; K8 -0.8,-0.8; K9 0,-0.8; K10 0.8,-0.8; K11 1.6,-0.8; K13 3.2,-0.8; K14 4,-0.8; K15 4.8,-0.8; K16 5.6,-0.8; K17 6.4,-0.8; L1 -6.4,-1.6; L2 -5.6,-1.6; L3 -4.8,-1.6; L4 -4,-1.6; L5 -3.2,-1.6; L7 -1.6,-1.6; L8 -0.8,-1.6; L9 0,-1.6; L10 0.8,-1.6; L11 1.6,-1.6; L13 3.2,-1.6; L14 4,-1.6; L15 4.8,-1.6; L16 5.6,-1.6; L17 6.4,-1.6; M1 -6.4,-2.4; M2 -5.6,-2.4; M3 -4.8,-2.4; M4 -4,-2.4; M5 -3.2,-2.4; M13 3.2,-2.4; M14 4,-2.4; M15 4.8,-2.4; M16 5.6,-2.4; M17 6.4,-2.4; N1 -6.4,-3.2; N2 -5.6,-3.2; N3 -4.8,-3.2; N4 -4,-3.2; N5 -3.2,-3.2; N6 -2.4,-3.2; N7 -1.6,-3.2; N8 -0.8,-3.2; N9 0,-3.2; N10 0.8,-3.2; N11 1.6,-3.2; N12 2.4,-3.2; N13 3.2,-3.2; N14 4,-3.2; N15 4.8,-3.2; N16 5.6,-3.2; N17 6.4,-3.2; P1 -6.4,-4; P2 -5.6,-4; P3 -4.8,-4; P4 -4,-4; P5 -3.2,-4; P6 -2.4,-4; P7 -1.6,-4; P8 -0.8,-4; P9 0,-4; P10 0.8,-4; P11 1.6,-4; P12 2.4,-4; P13 3.2,-4; P14 4,-4; P15 4.8,-4; P16 5.6,-4; P17 6.4,-4; R1 -6.4,-4.8; R2 -5.6,-4.8; R3 -4.8,-4.8; R4 -4,-4.8; R5 -3.2,-4.8; R6 -2.4,-4.8; R7 -1.6,-4.8; R8 -0.8,-4.8; R9 0,-4.8; R10 0.8,-4.8; R11 1.6,-4.8; R12 2.4,-4.8; R13 3.2,-4.8; R14 4,-4.8; R15 4.8,-4.8; R16 5.6,-4.8; R17 6.4,-4.8; T1 -6.4,-5.6; T2 -5.6,-5.6; T3 -4.8,-5.6; T4 -4,-5.6; T5 -3.2,-5.6; T6 -2.4,-5.6; T7 -1.6,-5.6; T8 -0.8,-5.6; T9 0,-5.6; T10 0.8,-5.6; T11 1.6,-5.6; T12 2.4,-5.6; T13 3.2,-5.6; T14 4,-5.6; T15 4.8,-5.6; T16 5.6,-5.6; T17 6.4,-5.6; U1 -6.4,-6.4; U2 -5.6,-6.4; U3 -4.8,-6.4; U4 -4,-6.4; U5 -3.2,-6.4; U6 -2.4,-6.4; U7 -1.6,-6.4; U8 -0.8,-6.4; U9 0,-6.4; U10 0.8,-6.4; U11 1.6,-6.4; U12 2.4,-6.4; U13 3.2,-6.4; U14 4,-6.4; U15 4.8,-6.4; U16 5.6,-6.4; U17 6.4,-6.4
SWD_DEBUG = smd 0.508 x 1.27: P1 -2.54,-2.54; P2 -2.54,2.54; P3 -1.27,-2.54; P4 -1.27,2.54; P5 0,-2.54; P6 0,2.54; P7 1.27,-2.54; P8 1.27,2.54; P9 2.54,-2.54; P10 2.54,2.54
1X03 = drill 1.016 long: 1 -2.54,0; 2 0,0; 3 2.54,0
CRYSTAL_3.2X2.5 = smd 1.4 x 1.2: 1 -1.1,-0.8; 2 1.1,0.8; GND1 -1.1,0.8; GND2 1.1,-0.8

## Placement (x,y rotation side)
A_MUX  TS3A27518EPWR  [TSSOP24]  120.35,47.54 90 top
ADV7125  ADV7125  [QFN50P700X700X100-49T495]  18,21.36 270 top
ARCH_ID  209-4MS  [EDG-04]  6.99,64.45 90 top
BOOT_MODE  209-3MS  [EDG-03]  62.2,36.16 90 top
C1  10uF  [C0402K]  41.6,62.27 180 top
C2  0.1uF  [C0201]  37.1,43.77 270 top
C3  0.1uF  [C0201]  35.6,43.77 270 top
C4  0.1uF  [C0201]  41.1,60.77 180 top
C5  0.1uF  [C0201]  41.1,59.77 0 top
C6  0.1uF  [C0201]  25.5,65.06 90 top
C7  0.1uF  [C0201]  22.9,65.06 90 top
C8  0.1uF  [C0201]  19.5,52.59 180 top
C9  0.1uF  [C0201]  23.6,43.77 270 top
C10  0.1uF  [C0201]  26.1,43.77 270 top
C11  10uF  [C0805]  113.2,8.77 0 top
C12  22uF  [C2012]  115.8,5.37 90 top
C13  0.1uF  [C0201]  41.1,63.77 180 top
C14  16pF  [C0201]  33.38,64.99 90 top
C15  16pF  [C0201]  29.82,69.66 180 top
C16  0.1uF  [C0201]  19.5,48.47 180 top
C17  2.2uF  [C0201]  19.53,51.21 180 top
C18  2.2uF  [C0201]  28.5,65.06 90 top
C19  0.1uF  [C0201]  22.6,80.64 180 top
C20  0.1uF  [C0201]  22.6,90.31 180 top
C21  0.1uF  [C0201]  22.6,71.81 180 top
C22  0.1uF  [C0201]  22.6,74.46 180 top
C23  0.1uF  [C0201]  22.6,78.66 180 top
C24  0.1uF  [C0201]  22.6,86.96 180 top
C25  0.1uF  [C0201]  131.32,44.64 90 top
C26  0.1uF  [C0201]  36.7,65.06 90 top
C27  0.1uF  [C0201]  19.53,61.86 180 top
C28  0.1uF  [C0201]  19.53,58.89 180 top
C29  0.1uF  [C0201]  19.5,56.15 180 top
C30  0.47uF  [C0201]  100,35.77 0 top
C31  0.1uF  [C0201]  41.1,47.77 180 top
C32  0.1uF  [C0201]  19.5,50.07 180 top
C33  0.1uF  [C0201]  41.1,51.77 180 top
C34  10uF  [C0402K]  41.6,65.27 0 top
C35  0.1uF  [C0201]  84.52,48.73 180 top
C36  0.47uF  [C0201]  100,34.87 0 top
C37  0.01uF  [C0201]  12.5,23.86 270 top
C38  0.1uF  [C0201]  13.5,23.86 270 top
C39  0.1uF  [C0201]  16.5,15.87 180 top
C40  0.1uF  [C0201]  17.5,16.36 0 top
C41  22uF  [C0805]  6,72.56 0 top
C42  1uF  [C0201]  3,71.36 180 top
C43  10uF  [C0402K]  2.4,73.36 180 top
C44  0.01uF  [C0201]  16.5,16.36 180 top
C45  0.1uF  [C0201]  21,16.36 90 top
C46  1uF  [C0201]  26.5,14.87 0 top
C47  0.47uF  [C0201]  100,39.37 180 top
C48  0.47uF  [C0201]  100,36.87 180 top
C49  0.47uF  [C0201]  100,30.86 180 top
C50  0.47uF  [C0201]  100,29.86 180 top
C51  0.47uF  [C0201]  100,26.36 180 top
C52  47uF  [C0805]  111.67,16.36 180 top
C53  0.1uF  [C0201]  54,90.86 270 top
C54  0.1uF  [C0201]  73.97,90.84 270 top
C55  0.1uF  [C0201]  94,90.86 270 top
C56  0.1uF  [C0201]  114,90.86 90 top
C57  0.1uF  [C0201]  136.4,24.57 90 top
C58  0.47uF  [C0201]  100,31.96 0 top
C59  4.7uF  [C0402]  103.8,29.16 0 top
C60  0.1uF  [C0201]  136.4,50.38 90 top
C61  0.1uF  [C0201]  136.31,37.45 90 top
C62  0.1uF  [C0201]  145,44.37 180 top
C63  0.1uF  [C0201]  136,45.87 0 top
C64  0.1uF  [C0201]  145,33.87 180 top
C65  0.1uF  [C0201]  136.5,33.87 0 top
C66  0.1uF  [C0201]  136.4,28.7 90 top
C67  0.1uF  [C0201]  136.4,52.07 90 top
C68  0.1uF  [C0201]  136.31,41.75 270 top
C69  0.1uF  [C0201]  136,44.87 0 top
C70  0.1uF  [C0201]  145,45.87 180 top
C71  0.1uF  [C0201]  145,32.37 180 top
C72  0.1uF  [C0201]  136.5,32.37 0 top
C73  100uF  [C0805]  110.2,32.23 270 top
C74  4.7uF  [C0402]  104,35.16 0 top
C75  4.7uF  [C0402]  106.9,36.37 90 top
C76  4.7uF  [C0402]  104,39.47 0 top
C77  100uF  [C0805]  109.27,26.36 180 top
C78  4.7uF  [C0402]  103.8,25.86 0 top
C79  4.7uF  [C0402]  72.5,32.37 180 top
C80  0.1uF  [C0201]  26.6,32.16 90 top
C81  0.1uF  [C0201]  134,90.86 270 top
C82  4.7uF  [C0402]  72.5,36.87 180 top
C83  0.47uF  [C0201]  77.5,39.37 180 top
C84  0.47uF  [C0201]  77.5,35.37 180 top
C85  0.47uF  [C0201]  77.5,32.37 180 top
C86  0.47uF  [C0201]  77.5,28.36 180 top
C87  0.1uF  [C0201]  34.8,24.56 90 top
C88  0.1uF  [C0201]  91.37,53.2 0 top
C89  0.1uF  [C0201]  156.12,77.22 180 top
C90  0.1uF  [C0201]  156.12,81.03 270 top
C91  0.1uF  [C0201]  156.12,83.57 0 top
C92  0.1uF  [C0201]  156.12,78.49 0 top
C93  0.01uF  [C0201]  17.5,15.87 0 top
C94  0.1uF  [C0201]  145.96,77.85 270 top
C96  0.1uF  [C0201]  121.6,52.84 90 top
C97  1uF  [C0201]  120.5,52.84 90 top
C98  0.1uF  [C0201]  30,32.59 270 top
C99  2.2uF  [C0201]  32.99,44.19 270 top
C100  0.1uF  [C0201]  112.23,42.82 180 top
C101  100uF  [C0805]  113,32.23 270 top
C102  4.7uF  [C0402]  104,32.87 0 top
C104  0.47uF  [C0201]  77.5,25.91 180 top
C106  0.1uF  [C0201]  68.01,53.36 0 top
C108  4.7uF  [C0402]  14,38.57 90 top
C109  22uF  [C0805]  126.1,3.46 0 top
C110  22uF  [C0805]  127.4,6.87 270 top
C111  0.01uF  [C0402]  120.9,5.77 270 top
C112  3900pF  [C0402]  121,3.37 180 top
C113  0.1uF  [C0201]  44.4,14.37 45 top
C114  0.1uF  [C0201]  91.8,12.56 90 top
C115  0.1uF  [C0201]  106,12.56 90 top
C116  0.1uF  [C0201]  136,30.56 180 top
C117  0.1uF  [C0201]  135.8,54.16 180 top
C118  0.1uF  [C0201]  55,94.36 180 top
C119  0.1uF  [C0201]  129.7,90.77 270 top
C120  0.1uF  [C0201]  69.9,90.56 270 top
C121  0.1uF  [C0201]  110,90.56 270 top
C122  0.1uF  [C0201]  90.4,90.77 270 top
C123  0.1uF  [C0201]  53.4,94.36 0 top
C124  0.1uF  [C0201]  69.9,89.16 90 top
C125  0.1uF  [C0201]  90.4,89.16 90 top
C126  0.1uF  [C0201]  134.2,54.16 0 top
C127  0.1uF  [C0201]  129.7,88.96 90 top
C128  0.1uF  [C0201]  110,88.96 90 top
C129  0.1uF  [C0201]  91.8,14.37 270 top
C130  0.1uF  [C0201]  106,14.37 270 top
C131  0.1uF  [C0201]  134,30.56 0 top
C132  0.1uF  [C0201]  45.8,15.76 225 top
C133  0.1uF  [C0201]  35.8,25.76 180 top
C134  0.1uF  [C0201]  3,72.36 0 top
C135  120pF  [C0201]  44.54,77.26 180 top
C136  0.01uF  [C0201]  44.54,75.51 180 top
C137  0.1uF  [C0201]  44.54,73.51 180 top
C138  0.1uF  [C0201]  26.6,33.57 270 top
C139  10uF  [C0805]  144.2,11.37 180 top
C140  10uF  [C0805]  144.2,14.67 180 top
C141  10uF  [C0805]  144.2,17.96 180 top
C142  0.1uF  [C0402]  138.55,18.81 90 top
C143  1.2nF  [C0603]  146.3,5.52 180 top
C144  13pF  [C0805]  145.85,8.12 0 top
C145  560pF  [C0402]  142.95,0.86 0 top
C146  33uF  [C0805]  132.4,11.37 90 top
C167  0.1uF  [C0201]  22.6,91.41 180 top
C168  0.1uF  [C0201]  26.81,94.83 0 top
C169  0.1uF  [C0201]  22.6,82.52 180 top
C170  0.1uF  [C0201]  40.26,75.55 0 top
C171  0.1uF  [C0201]  40.28,85.9 0 top
C172  0.1uF  [C0201]  40.26,72.69 0 top
C173  1uF  [C0201]  23.91,30.65 270 top
C177  4.7uF  [C0201]  40.46,88.82 0 top
CARTRIDGE  5650118-1  [A8_CART]  164.66,44.62 90 top
D1  BAT54S  [SOT23]  35.51,7.16 0 top
D2  BAT54S  [SOT23]  39.71,7.16 0 top
DBG0  YELLOW_LED  [CHIPLED_0603]  16.44,98.88 270 top
DBG1  YELLOW_LED  [CHIPLED_0603]  16.44,97.1 270 top
DBG2  YELLOW_LED  [CHIPLED_0603]  16.44,95.33 270 top
EXP_POWER  [1X02]  5.08,26.04 180 top
EXPANSION  [2X06]  43.18,32.39 90 top
FPGA_1_0  TLV62095  [QFN50P310X310X100-16]  124,6.57 270 top
FPGA_CFG  W25Q80DVSNIG  [SOIC8_150MIL]  127.54,46.67 180 top
FPGA_DONE  LTST-C191KFKT  [CHIPLED_0603]  99.94,22.57 90 top
FPGA_PROG  XILINX-JTAG  [332-14]  50,27.36 270 top
H1  MOUNT-HOLE3.2  [3,2]  5,19.36 0 top
H2  MOUNT-HOLE3.2  [3,2]  165,5 0 top
H4  MOUNT-HOLE3.2  [3,2]  5,94.36 0 top
H5  MOUNT-HOLE3.2  [3,2]  150,94.36 0 top
HOST_IO  [2X20/90]  83.34,0.6 180 top
IO_EXP  MCP23S17T-E/SS  [SSOP28]  69.4,47.57 180 top
J1  12401598E4#2A  [AMPHENOL_12401598E4#2A]  49.15,9.95 0 top
L1  1.5uH  [L5650M]  125,12.56 0 top
L2  2.2uH  [RESC4137X200]  134.3,5.12 180 top
L3  470nH  [L0603]  114,11.17 0 top
LD_0ACT  LTST-C191KRKT  [CHIPLED_0603]  61.2,97.16 270 top
LD_0P  SML-D12D1WT86  [CHIPLED_0603]  61.2,98.77 270 top
LD_1ACT  LTST-C191KRKT  [CHIPLED_0603]  80.8,97.16 270 top
LD_1P  SML-D12D1WT86  [CHIPLED_0603]  80.8,98.77 270 top
LD_2ACT  LTST-C191KRKT  [CHIPLED_0603]  100.8,97.36 270 top
LD_2P  SML-D12D1WT86  [CHIPLED_0603]  100.8,98.96 270 top
LD_3ACT  LTST-C191KRKT  [CHIPLED_0603]  121.4,97.16 270 top
LD_3P  SML-D12D1WT86  [CHIPLED_0603]  121.4,98.77 270 top
LD_4ACT  LTST-C191KRKT  [CHIPLED_0603]  141.2,97.36 270 top
LD_4P  SML-D12D1WT86  [CHIPLED_0603]  141.2,98.96 270 top
LD_7DBG0  IN-S63BTA  [CHIPLED_0603]  48.6,95.56 270 top
LD_7DBG1  IN-S63BTA  [CHIPLED_0603]  48.6,97.16 270 top
LD_7DBG2  IN-S63BTA  [CHIPLED_0603]  48.6,98.77 270 top
LD_AUX  LTST-S270GKT  [CHIPLED_0603]  167.12,16.51 0 top
LD_INT  LTST-S270GKT  [CHIPLED_0603]  168.71,16.51 0 top
LD_V33  LTST-S270GKT  [CHIPLED_0603]  165.55,16.51 0 top
LVL_AHI  SN74LVC8T245  [TSSOP24]  141.45,51.04 0 top
LVL_ALO  SN74LVC8T245  [TSSOP24]  141.45,26.65 0 top
LVL_D  SN74LVC8T245  [TSSOP24]  141.45,39.45 0 top
MEM_ID  209-2MS  [EDG-02]  6.99,43.5 90 top
MUX-HI  IDTQS3VH257  [SO16]  95.46,47.88 0 top
MUX-LO  IDTQS3VH257  [SO16]  108.16,47.88 180 top
OSC1  50 MHz oscillator  [OSC_3.2X2.5MM]  83.75,45.25 270 top
PEXT_10  [1X02]  127,22.36 90 top
PEXT_18  [1X02]  115,22.36 90 top
PEXT_33  [2X02]  150,22.36 0 top
PID  209-3MS  [EDG-03]  6.99,52.71 90 top
POWER  dc5vin  [DCJ3P-14.2X11.0X9.0MM]  154,6.46 90 top
PSW  NCP380  [SOT23-6]  21.43,31.64 0 top
Q1  BSS138  [SOT23]  35.51,2.56 180 top
Q2  BSS138  [SOT23]  39.91,2.36 180 top
Q3  BC817-16LT3G  [SOT23-R]  163.03,13.2 270 top
Q4  BC817-16LT3G  [SOT23-R]  162.94,18.6 270 top
R1  0R  [R0201]  31.1,40.27 270 top
R2  130R  [R0402]  12.48,98.88 0 top
R3  130R  [R0402]  12.48,97.1 0 top
R4  130R  [R0402]  12.48,95.33 0 top
R5  0R  [R0201]  29.5,40.27 90 top
R6  47K  [R0201]  14.1,68.27 0 top
R7  47K  [R0201]  14.1,65.77 0 top
R8  47K  [R0201]  14.1,63.16 0 top
R9  47K  [R0201]  14.1,60.66 0 top
R10  560R  [R0201]  23.5,18.36 180 top
R11  1K  [R0201]  145.96,83.57 0 top
R12  1K  [R0201]  145.96,84.84 0 top
R13  1K  [R0201]  22,16.36 270 top
R14  47K  [R0201]  13.97,55.25 0 top
R15  47K  [R0201]  14,52.66 0 top
R16  47K  [R0201]  14,50.16 0 top
R17  47K  [R0201]  14,44.57 0 top
R18  47K  [R0201]  14,42.37 0 top
R19  75R  [R0201]  20,16.36 90 top
R20  75R  [R0201]  18.5,16.36 270 top
R21  33R  [R0201]  42.6,63.77 0 top
R22  75R  [R0201]  15.5,16.36 270 top
R23  4.7K  [R0201]  23.5,19.36 0 top
R24  0R  [R0201]  15,26.36 270 top
R26  33R  [R0201]  41.1,49.27 180 top
R27  33R  [R0201]  41.1,50.27 180 top
R36  47K  [R0402]  13.2,72.56 90 top
R37  47K  [R0402]  14.6,72.56 90 top
R38  47K  [R0402]  9,72.56 90 top
R39  47K  [R0402]  10.4,72.56 90 top
R40  47K  [R0402]  11.8,72.56 90 top
R41  47K  [R0402]  16,72.56 90 top
R50  1K  [R0201]  39.91,10.16 0 top
R51  1K  [R0201]  35.51,10.16 180 top
R52  33R  [R0201]  100,33.57 0 top
R53  0R  [R0201]  32.9,40.27 90 top
R54  2.4K  [R0201]  131.32,47.75 270 top
R55  2.4K  [R0201]  126.25,51.78 0 top
R56  1M  [R0402]  113,3.57 180 top
R57  2.4K  [R0201]  128.75,51.78 180 top
R58  1K  [R0201]  82.7,48.77 0 top
R59  10K  [R0201]  102.9,30.86 180 top
R60  33R  [R0201]  100,28.36 0 top
R61  10K  [R0201]  54,87.86 90 top
R62  10K  [R0201]  73.97,87.64 90 top
R63  10K  [R0201]  94,87.36 90 top
R64  10K  [R0201]  114,87.36 90 top
R65  10K  [R0201]  134,87.36 90 top
R66  200R  [R0201]  105.4,22.56 270 top
R67  150R  [R0402]  168.71,13.65 90 top
R68  100R  [R0402]  103.5,22.46 0 top
R69  4.7K  [R0201]  106,16.76 90 top
R70  4.7K  [R0201]  115.33,47.07 90 top
R71  4.7K  [R0201]  119.3,52.89 90 top
R72  0R  [R0201]  42.6,60.77 180 top
R73  33R  [R0201]  77.5,38.37 0 top
R74  33R  [R0201]  77.5,37.37 0 top
R75  33R  [R0201]  77.5,36.37 0 top
R76  330R  [R0402]  160.21,13.53 270 top
R77  150R  [R0402]  167.12,13.65 90 top
R78  4.7K  [R0201]  77.5,33.37 0 top
R79  4.7K  [R0201]  77.5,30.86 0 top
R80  330R  [R0402]  160.19,18.62 270 top
R81  10K  [R0201]  102.8,27.66 0 top
R82  10K  [R0201]  53.8,31.36 180 top
R83  10K  [R0201]  53.8,29.36 180 top
R84  10K  [R0201]  53.8,27.36 180 top
R85  10K  [R0201]  53.8,25.36 180 top
R87  59R  [R0402]  58.2,98.77 0 top
R88  10K  [R0201]  33.3,38.59 180 top
R89  10K  [R0201]  35.81,38.57 0 top
R90  10K  [R0201]  30.07,35.04 90 top
R91  33R  [R0201]  26.9,65.06 90 top
R92  33R  [R0201]  41.2,55.16 0 top
R93  33R  [R0201]  41.2,56.27 0 top
R94  130R  [R0402]  58.2,97.16 0 top
R98  59R  [R0402]  77.8,98.77 0 top
R99  130R  [R0402]  77.8,97.16 180 top
R101  59R  [R0402]  97.8,98.96 0 top
R102  130R  [R0402]  97.8,97.36 180 top
R104  59R  [R0402]  118.4,98.77 0 top
R105  130R  [R0402]  118.4,97.16 0 top
R107  59R  [R0402]  138.2,98.96 0 top
R108  130R  [R0402]  138.2,97.36 0 top
R109  130R  [R0402]  45.6,95.56 0 top
R110  130R  [R0402]  45.6,97.16 0 top
R111  130R  [R0402]  45.6,98.77 0 top
R112  59R  [R0402]  165.55,13.65 90 top
R113  50R  [R0201]  74.6,25.06 270 top
R114  50R  [R0201]  72.5,25.56 90 top
R115  50R  [R0201]  64,27.56 270 top
R116  50R  [R0201]  67.1,27.76 90 top
R117  50R  [R0201]  64.1,24.06 90 top
R118  50R  [R0201]  63.9,22.46 270 top
R119  100K  [R0201]  23.9,32.29 90 top
R120  10K  [R0201]  22.57,83.79 0 top
R121  10K  [R0201]  40.27,83.44 180 top
R122  1K  [R0201]  14.1,59.16 180 top
R123  1K  [R0201]  14,46.57 180 top
R124  1K  [R0201]  14,48.47 180 top
R125  47K  [R0201]  68.9,38.66 0 top
R126  47K  [R0201]  68.9,36.07 0 top
R127  47K  [R0201]  68.9,33.66 0 top
R128  1K  [R0201]  54.5,33.66 0 top
R129  499K  [R0402]  119.6,12.67 270 top
R130  40.2K  [R0402]  120,8.27 180 top
R131  160K  [R0402]  119.6,10.27 90 top
R133  10.5R  [R0402]  135.35,17.51 0 top
R134  48.7K  [R0402]  140.35,18.31 270 top
R135  6.04K  [R0805]  145.75,3.07 0 top
R136  12K  [R0805]  142.25,4.46 90 top
R137  2.67K  [R0402]  141.35,7.81 0 top
R138  64.9R  [R0402]  146.7,0.86 0 top
R139  105K  [R0201]  139.9,5.92 90 top
RESET_S7  Tac-switch  [TACTILE-PTH]  98.94,14.32 180 top
RESET_XIO  TAC_SWITCH  [TACTILE-PTH]  48.44,87.04 270 top
SD_SLOT  5025700893  [5025700893]  8.4,82.28 90 top
SDRAM  IS42S32160F-7TLI  [SOP50P1176X120-86]  31.6,82.36 0 top
SERIAL0  9-way D  [DB9]  160.66,84.45 270 top
SERIAL_BUF0  MAX3232ECDR  [SO16']  151.04,81.66 90 top
SLOT0  PCIE_64  [PCI-E_64]  60,79.36 270 top
SLOT1  PCIE_64  [PCI-E_64]  80,79.36 270 top
SLOT2  PCIE_64  [PCI-E_64]  100,79.36 270 top
SLOT3  PCIE_64  [PCI-E_64]  120,79.36 270 top
SLOT4  PCIE_64  [PCI-E_64]  140,79.36 270 top
SPI_DBG  [1X05]  50,75.36 90 top
U$5  74LVC1T45GWSOT866  [SOT886]  143,45.37 0 top
U$6  74LVC1T45GWSOT866  [SOT886]  139,45.37 0 top
U$7  74LVC1T45GWSOT866  [SOT886]  143,33.37 0 top
U$8  74LVC1T45GWSOT866  [SOT886]  139,33.37 0 top
USB  MINI-USB-UX60-MB-5ST  [UX60-MB-5ST]  6.4,33.76 0 top
USB_ESD  PUSB2X4YH  [SOT363]  17.46,39.97 270 top
VGA  15-way D  [DB15]  16.1,3.81 180 top
VREG_18  TPS62087RLTR  [RLT0007A]  113.2,5.96 90 top
VREG_33  LM21212  [HTSSOP20]  138.3,12.62 180 top
VREG_MON  TPS3808G33DBVR  [SOT23-6]  44.54,79.76 270 top
VREG_VGA  AD1580ARTZ  [SOT23]  26.5,17.86 0 top
XC7S25  XC7S25  [BGA196C100P14X14_1500X1500X146]  88,32.37 270 top
XIO  STM32H743-XIO  [BGA289C80P17X17_1400X1400X110]  31.1,55.27 270 top
XIO-SWD  XIO_JTAG  [SWD_DEBUG]  34.48,34.19 0 top
XSPI5_DBG  [1X03]  50,49.37 90 top
XSPI6_DBG  [1X03]  50,40.37 90 top
Y2  FA-238 25.0000MB-K3  [CRYSTAL_3.2X2.5]  31.11,66.71 270 top

## Tracks (layer width: path | path; a pad name or v marks a point on that pad's centre or on a via)
!ADDR_VALID_READ!  (via drill 0.2 pad 0.48)
  Top 0.102: v92,41.87 61.5,41.87 59,44.37 53.5,44.37 52.5,45.37 v52.5,47.37 | v92,39.37 XC7S25.D1 | v28.3,61.27 XIO.M2
  Route3 0.102: v28.3,61.27 28.7,61.66 28.7,63.57 29.5,64.36 34.5,64.36 35,64.86 46,64.86 v47.5,63.37
  Route14 0.102: v92,39.37 v92,41.87
  Bottom 0.102: v52.5,47.37 52.5,62.37 51.5,63.37 v47.5,63.37
!ADDR_VALID_WRITE!  (via drill 0.2 pad 0.48)
  Top 0.102: v93,39.37 XC7S25.C1 | v28.3,60.47 XIO.M3
  Route3 0.102: v92.5,91.36 91.5,92.36 57,92.36 56.5,91.86 v33.5,91.86
  Route14 0.102: v93,39.37 v93,41.87
  Bottom 0.102: v28.3,60.47 XIO.M3 28.7,59.27 30.4,59.27 30.5,59.37 30.5,76.36 33.5,79.36 v33.5,91.86 | v93,41.87 93,49.37 92.5,49.87 v92.5,91.36
!GEN_CCTL!  (via drill 0.2 pad 0.48)
  Top 0.102: v142,49.37 142.42,48.94 LVL_AHI.8 | v90,36.37 XC7S25.F4
  Route3 0.102: v90,36.37 90.5,36.87 90.5,39.87 91.5,40.87 102,40.87 105.5,44.37 105.5,48.87 106,49.37 128,49.37 129,48.37 141,48.37 v142,49.37
!GEN_S4!  (via drill 0.2 pad 0.48)
  Top 0.102: v89,42.37 108,42.37 109.5,40.87 130.5,40.87 132.5,42.87 132.5,45.37 134.5,47.37 143.07,47.37 LVL_AHI.9 | v87,37.37 XC7S25.H3
  Route14 0.102: v87,37.37 88,37.37 88.5,37.87 88.5,41.87 v89,42.37
!GEN_S5!  (via drill 0.2 pad 0.48)
  Top 0.102: v109,40.37 133,40.37 136.5,43.87 140.5,43.87 140.5,45.87 141.5,46.87 143.22,46.87 143.72,47.37 LVL_AHI.10 | v87,38.37 XC7S25.H2
  Route14 0.102: v87,38.37 87.5,38.87 87.5,47.87 89.5,49.87 108,49.87 109,48.87 v109,40.37
!IO_EXP_IRQ!  (via drill 0.2 pad 0.48)
  Top 0.102: v53.5,45.37 54,45.87 67.5,45.87 67.78,45.59 IO_EXP.19 67.78,42.87 68.42,42.87 IO_EXP.20 | v35.5,60.47 XIO.D3
  Route14 0.102: v35.5,60.47 35.9,60.87 35.9,62.27 36.5,62.87 v47,62.87
  Bottom 0.102: v47,62.87 51,62.87 52,61.87 52,46.87 v53.5,45.37
!IO_EXP_SEL!  (via drill 0.2 pad 0.48)
  Top 0.102: v67,52.37 67.12,52.24 IO_EXP.11 | v27.5,61.27 XIO.N2
  Route3 0.102: v27.5,61.27 XIO.N2 30.5,60.87 30.5,57.37 31,56.87 40.5,56.87 41.5,55.87 41.5,55.37 42.5,54.37 66.5,54.37 66.5,52.87 v67,52.37
!MR!  (via drill 0.2 pad 0.48)
  Top 0.102: 45.5,75.5 C136.1 | 45.5,75.5 45.14,75.86 44.39,75.86 43.39,76.86 VREG_MON.3 | v48,75.86 45.86,75.86 45.5,75.5
  Route14 0.102: v48,75.86 48,81.09 RESET_XIO.2 RESET_XIO.1
!RESET!  (via drill 0.2 pad 0.48)
  Top 0.102: v42.5,76.86 42.5,80.7 VREG_MON.1 | v41.5,44.87 41.5,41.87 39.5,39.87 37.5,39.87 v37,39.37 36.07,39.37 R89.2 | v40,49.87 39.25,50.62 39.25,56.87 38.5,57.62 38.5,61.87 v39,62.37 | v30,33.37 C98.1 | v67,45.37 67.12,45.24 IO_EXP.18 | XIO-SWD.P10 37.02,35.38 v37,35.37 | v29.9,62.07 XIO.K1
  Route3 0.102: v29.5,75.86 29.5,76.86 v42.5,76.86 | v29.9,62.07 XIO.K1 34.5,61.66 35.39,62.56 38.81,62.56 v39,62.37 | v37,35.37 v37,39.37 | v41.5,44.87 66.5,44.87 v67,45.37
  Route14 0.102: v29.9,62.07 29.9,75.46 v29.5,75.86 | v41.5,44.87 43,46.37 43,48.87 42,49.87 v40,49.87 | v37,35.37 35,33.37 v30,33.37
!SDRAM_CAS!  (via drill 0.2 pad 0.48)
  Top 0.102: v24.5,86.36 24.5,84.47 24.6,84.36 SDRAM.18 | XIO.D6 v35.5,58.07
  Route3 0.102: v27.55,86.36 26.38,86.36 26.28,86.47 26.28,93.35 26.18,93.45 25.98,93.45 25.87,93.35 25.87,85.82 25.77,85.72 25.57,85.72 25.47,85.82 25.47,92.71 25.37,92.81 25.16,92.81 25.06,92.71 25.06,86.47 24.96,86.36 v24.5,86.36
  Route14 0.102: v35.5,58.07 35.5,58.36 35.4,58.47 34.4,58.47 34.3,58.57 34.3,62.26 34.4,62.37 34.65,62.37 34.75,62.47 34.75,70.54 34.65,70.64 34.5,70.64 34.5,85.26 34.4,85.36 33.28,85.36 33.18,85.47 33.18,86.55 33.08,86.65 32.87,86.65 32.77,86.55 32.77,84.25 32.67,84.15 32.47,84.15 32.37,84.25 32.37,86.55 32.27,86.65 32.06,86.65 31.96,86.55 31.96,85.47 31.86,85.36 31.66,85.36 31.55,85.47 31.55,86.55 31.45,86.65 31.25,86.65 31.15,86.55 31.15,85.47 31.05,85.36 30.84,85.36 30.74,85.47 30.74,86.55 30.64,86.65 30.44,86.65 30.33,86.55 30.33,84.42 30.23,84.31 30.03,84.31 29.93,84.42 29.93,86.55 29.83,86.65 29.62,86.65 29.52,86.55 29.52,84.94 29.42,84.83 29.22,84.83 29.11,84.94 29.11,85.91 29.01,86.01 28.81,86.01 28.71,85.91 28.71,85.47 28.61,85.36 27.6,85.36 27.55,85.42 v27.55,86.36
!SDRAM_RAS!  (via drill 0.2 pad 0.48)
  Top 0.102: v28.5,83.86 SDRAM.19 | XIO.T7 v25.1,57.27
  Bottom 0.102: v25.1,57.27 25.4,57.27 25.5,57.37 25.5,60.76 25.4,60.87 25.1,60.87 25,60.97 25,62.08 25.1,62.19 25.54,62.19 25.64,62.29 25.64,62.49 25.54,62.59 25.1,62.59 25,62.69 25,62.9 25.1,63 25.54,63 25.64,63.1 25.64,63.3 25.54,63.41 25.1,63.41 25,63.51 25,63.71 25.1,63.81 25.54,63.81 25.64,63.91 25.64,64.12 25.54,64.22 25.1,64.22 25,64.32 25,64.52 25.1,64.62 25.54,64.62 25.64,64.73 25.64,64.93 25.54,65.03 25.1,65.03 25,65.13 25,65.33 25.1,65.44 25.54,65.44 25.64,65.54 25.64,65.74 25.54,65.84 25.1,65.84 25,65.94 25,66.15 25.1,66.25 25.54,66.25 25.64,66.35 25.64,66.55 25.54,66.66 25.1,66.66 25,66.76 25,66.96 25.1,67.06 25.54,67.06 25.64,67.16 25.64,67.37 25.54,67.47 25.1,67.47 25,67.57 25,71.02 25.1,71.13 27,71.13 27.1,71.23 27.1,71.43 27,71.53 25.1,71.53 25,71.63 25,71.84 25.1,71.94 27,71.94 27.1,72.04 27.1,72.24 27,72.35 25.1,72.35 25,72.45 25,72.65 25.1,72.75 27,72.75 27.1,72.85 27.1,73.06 27,73.16 25.1,73.16 25,73.26 25,74.34 25.1,74.45 25.4,74.45 25.5,74.55 25.5,75.67 25.6,75.77 27.09,75.77 27.2,75.87 27.2,76.07 27.09,76.17 25.6,76.17 25.5,76.27 25.5,76.48 25.6,76.58 27.14,76.58 27.2,76.63 27.2,76.71 27.08,76.83 27.23,76.98 27.23,83.76 27.33,83.86 27.53,83.86 27.63,83.76 27.63,79.83 27.73,79.73 27.94,79.73 28.04,79.83 28.04,83.76 28.14,83.86 v28.5,83.86
!SDRAM_WE!  (via drill 0.2 pad 0.48)
  Top 0.102: v27.5,84.36 27.5,84.76 27.4,84.86 SDRAM.17 | XIO.P4 v26.7,59.66
  Route14 0.102: v26.7,59.66 26.7,60.76 26.6,60.87 26.1,60.87 26,60.97 26,63.71 26.1,63.81 26.54,63.81 26.64,63.91 26.64,64.12 26.54,64.22 24.81,64.22 24.71,64.32 24.71,64.52 24.81,64.62 26.54,64.62 26.64,64.73 26.64,64.93 26.54,65.03 24.81,65.03 24.71,65.13 24.71,65.33 24.81,65.44 26.54,65.44 26.64,65.54 26.64,65.74 26.54,65.84 26.1,65.84 26,65.94 26,68.76 26.1,68.86 26.4,68.86 26.5,68.97 26.5,72.52 26.6,72.62 27.45,72.62 27.55,72.73 27.55,72.93 27.45,73.03 26.6,73.03 26.5,73.13 26.5,73.33 26.6,73.44 28.09,73.44 28.2,73.54 28.2,73.74 28.09,73.84 26.6,73.84 26.5,73.94 26.5,74.15 26.6,74.25 28.09,74.25 28.2,74.35 28.2,74.55 28.09,74.66 26.6,74.66 26.5,74.76 26.5,74.96 26.6,75.06 27.45,75.06 27.55,75.16 27.55,75.37 27.45,75.47 26.6,75.47 26.5,75.57 26.5,75.77 26.6,75.88 27.45,75.88 27.55,75.98 27.55,76.18 27.45,76.28 26.6,76.28 26.5,76.38 26.5,77.4 26.6,77.5 28.09,77.5 28.2,77.6 28.2,77.81 28.09,77.91 26.6,77.91 26.5,78.01 26.5,78.21 26.6,78.31 27.45,78.31 27.55,78.41 27.55,78.62 27.45,78.72 26.6,78.72 26.5,78.82 26.5,79.02 26.6,79.13 27.45,79.13 27.55,79.23 27.55,79.43 27.45,79.53 26.6,79.53 26.5,79.63 26.5,80.65 26.6,80.75 29.62,80.75 29.72,80.85 29.72,81.06 29.62,81.16 26.6,81.16 26.5,81.26 26.5,81.46 26.6,81.56 29.62,81.56 29.72,81.67 29.72,81.87 29.62,81.97 26.6,81.97 26.5,82.07 26.5,82.28 26.6,82.38 29.55,82.38 29.65,82.48 29.65,82.68 29.55,82.78 26.6,82.78 26.5,82.89 26.5,83.09 26.6,83.19 28.09,83.19 28.2,83.29 28.2,83.49 28.09,83.6 26.6,83.6 26.5,83.7 26.5,84.26 26.6,84.36 v27.5,84.36
!SPI_IRQ!  (via drill 0.2 pad 0.48)
  Top 0.102: v84,38.37 XC7S25.L2 | v35.5,61.27 XIO.D2
  Route3 0.102: v35.5,61.27 35.9,60.87 46,60.87 47,59.87 47,54.87 69,54.87 70.5,53.37 v85.5,53.37
  Route14 0.102: v84,38.37 84.5,38.87 84.5,47.37 v85.5,48.37
  Bottom 0.102: v85.5,48.37 v85.5,53.37
+3V3  (via drill 0.2, 0.2 pad 0.48)
  Top 0.102: ADV7125.13 14.55,25.36 13.55,26.36 10.83,26.36 10.5,26.04 EXP_POWER.1 | SDRAM.75 v39,87.36 | SDRAM.15 29,85.86 v29,88.36 | C21.1 22.85,72.36 22.35,72.86 v21,72.86 | R136.1 143.35,3.52 143.35,1.72 143.1,1.47 136,1.47 | C6.1 25,64.81 25,69.36 25.5,69.86 26.5,69.86 27,69.36 27,67.36 v26.5,66.86 | C10.1 26.85,44.02 v27,43.87 | C29.1 19.75,55.62 19.5,55.37 19,55.37 v18,54.37 | v17,13.37 17.5,13.87 17.5,14.87 17.25,15.12 C93.1 C40.1 ADV7125.29 ADV7125.30 | 45.9,15.99 45.98,15.99 C132.1 45.95,15.94 45.9,15.99 | 45.9,15.99 42.88,15.99 v42.5,16.36 | C96.1 121.22,52.59 121,52.37 v121,51.37 | C172.1 v40,70.36 | C28.1 19.78,57.15 v19.5,56.87 | R38.2 v9,74.36 | C77.1 v111.5,26.36 | C22.1 22.85,73.86 23.35,73.36 v24,73.36 | C48.1 100.25,38.12 v100,38.37 | C27.1 19.78,61.37 v21.5,61.37 | R116.2 67.94,28.02 v68,27.96 | C7.1 22.45,64.81 v21.5,63.87 | R5.1 27.64,40.01 v27.5,39.87 | Q1.1 36.46,3.37 v38,3.37 | C20.1 22.85,90.36 v24,90.36 | C86.1 v78.5,28.36 | C65.1 v135.5,33.87 | C49.1 100.25,30.36 v99,30.36 | v17,14.37 16.75,14.62 C39.1 C44.1 | C33.1 41.35,51.37 v40,51.37 | R79.2 78.25,30.36 v79,30.36 | C97.1 120,52.59 v120,51.37 | R37.2 14.6,73.96 v15,74.36 | R90.1 30.07,34.37 v31,34.37 | C126.1 133.3,54.16 v132.5,53.37 | C78.1 102.5,25.86 v102,26.36 | C35.1 84.77,48.37 85.27,47.87 v87,47.87 | C8.1 19.75,54.61 v19.5,54.87 | R40.2 12,73.06 v12,74.36 | R36.2 13,73.06 v13,74.36 | R2.1 11.48,98.88 v11,99.36 | C129.1 91.25,14.62 91,14.37 v91,13.37 | C2.1 37,44.02 v37,45.37 | C76.1 103.35,38.72 v103,38.37 | C3.1 35.5,44.02 v35.5,45.37 | R4.1 12,95.33 v12,93.86 | C16.1 19.75,48.37 v21,48.37 | C82.1 72.5,36.87 v72.5,37.87 | R69.2 v106,18.36
  Top 0.102: R59.1 103.16,30.36 v104,30.36 | R113.2 74.6,24.26 v75,23.86 | R88.1 33.55,39.37 v33,39.37 | R41.2 v16,74.36 | C169.1 23.85,82.52 v24,82.36 | R53.1 32.35,40.01 v32,40.37 | R118.2 64.95,22.21 v65,22.16 | C85.1 v79,32.37 | C84.1 v80,35.37 | C50.1 101,29.86 v101,30.36 | C5.1 40.85,59.37 v40,59.37 | C83.1 v79,39.37 | C63.1 135.75,46.37 v135,46.37 | C41.1 5.05,71.41 v5,71.36 | C38.1 v13.5,25.36 | C64.1 v147.5,33.87 | R78.2 v79,33.37 | R23.2 24.25,19.86 v25.5,19.86 | R3.1 11.98,96.36 v11.5,96.36 | R112.1 165.55,12.37 v166,12.37 | Q2.1 41.91,3.46 v42,3.37 | C94.2 145.24,77.6 v145,77.36 | C138.1 26.6,34.27 26.5,34.37 v26,34.37 | C79.1 73,32.37 v73,31.36 | C123.1 v52,94.36 | C26.1 36.7,64.36 v36,64.36 | R57.2 128.5,52.37 v128,52.37 | C31.1 41.35,47.37 v42,47.37 | R66.2 105.5,22.31 105.56,22.36 v106,22.36 | R58.1 82.44,49.37 v82,49.37 | R121.1 40.53,82.83 v41,82.36 | C168.1 26.56,94.36 v26,94.36 | C43.1 v3,74.36 | C100.1 112.48,42.37 v113,42.37 | C88.1 91.12,52.49 v91,52.37 | C32.1 19.75,49.62 v20,49.37 | C131.1 133.2,30.56 v133,30.36 | C4.1 41.35,61.12 41.11,61.37 v41,61.37 | R117.2 64.1,24.36 v65,24.36 | R82.1 v55,31.36 | R123.1 14.8,46.57 v15,46.37 | R11.1 145.21,83.57 v145,83.36 | R55.2 126.51,51.37 v127,51.37 | C34.1 v41,64.36 | R39.2 10.4,73.86 v9.5,73.86 | C167.1 22.85,90.86 v21.5,90.86 | C19.1 22.85,81.21 v23,81.36 | R89.1 35,38.57 v35,40.37 | C61.1 136.84,37.2 v137,37.37 | C137.1 44.79,72.08 v45,71.86 | C23.1 22.85,79.21 v23,79.36 | R124.1 14.26,48.37 v15,48.37 | R122.1 14.8,59.16 v15,59.37 | C60.1 136.77,50.13 v137,50.37 | C170.1 v40,76.36 | R54.2 131.87,47.49 v132,47.37 | C45.1 v21,15.37 | C134.2 v4,72.36 | C42.1 v4,71.36 | C47.1 v101,39.37 | C130.1 v106,15.37
  Top 0.102: C106.2 v68.99,53.36 v69,53.37 | C62.1 v146,44.37 | C177.1 40.21,89.16 v40,89.36 | C9.1 23.15,44.02 v23,43.87 | C37.1 v12.5,25.86 | R13.2 v22,15.37 | R21.2 42.85,64.22 v43,64.36 | C25.1 131.32,44.37 v132,44.37 | C57.1 136.96,24.32 v137,24.36 | C171.1 40.03,85.86 40,85.83 v40,85.36 | R114.2 v72.5,26.36 | C133.1 36.05,25.36 37.05,24.36 42.78,24.36 EXPANSION.1 | R83.1 54.05,28.86 | 54.05,28.86 52.5,28.86 52,29.36 52,29.86 51.5,30.36 50.5,30.36 50,30.86 50,32.37 FPGA_PROG.2 52,33.37 52.3,33.66 R128.1 | VREG_MON.5 45,79.75 44.5,79.25 v44.5,78.36 | U$5.1 142,45.87 v142,46.37 | U$8.6 139.34,34.2 139.5,34.37 v140,34.37 | U$7.6 144,33.87 v144,34.37 | U$6.1 138.66,46.2 138.5,46.37 v138,46.37 | VREG_MON.6 45.69,81.12 45.93,81.36 v46,81.36 | OSC1.4 84.55,47.37 v85.5,47.37 | U$6.5 v140,45.37 | U$5.5 v144,45.37 | FPGA_CFG.8 129.45,42.81 v129,42.37 | C24.1 22.85,86.52 v23,86.36 | XIO-SWD.P1 32,31.65 v32,30.36 | SD_SLOT.P$4 4.5,82.88 4.51,82.86 v6,82.86 | MUX-LO.16 112.6,43.87 v113.5,43.87 | MUX-HI.16 91.01,48.38 v91,48.37 | SERIAL_BUF0.16 149.65,77.22 v150,76.86 | LVL_AHI.2 138.52,49.84 v138,50.37 | A_MUX.16 116.3,49.16 116,48.87 v116,48.37 | LVL_AHI.1 137.87,49.24 v138,49.37 | LVL_ALO.2 138.52,24.89 v139,25.36 | A_MUX.18 116.5,47.86 v116,47.37 | LVL_ALO.1 137.87,25.24 v138,25.36 | A_MUX.8 122.15,48.51 v122,48.37 | LVL_D.1 137.87,35.49 v138,35.37 | IO_EXP.9 68.42,52.37 v69,52.37 | C124.1 69.9,88.36 71.84,86.42 SLOT1.B6 | C128.1 110,88.36 111.94,86.42 SLOT3.B6 | C125.1 94.51,88.91 SLOT2.B6 | C127.1 129.7,88.36 128.7,87.36 123,87.36 122.5,87.86 122.5,88.42 SLOT3.A3 | R12.1 145.71,85.36 143,85.36 142,84.36 140.06,84.36 SLOT4.B7
  Top 0.102: SDRAM.49 36,74.36 v36,73.86 | SDRAM.3 27,91.86 v27,93.36 | SDRAM.35 27.5,75.86 v28,76.36 | SDRAM.43 24.5,71.86 v24,72.36 | SDRAM.29 24.5,78.86 v24,78.36 | SDRAM.41 v28,72.86 | SDRAM.9 v28,88.86 | SDRAM.1 25,92.86 v25,93.36 | SDRAM.55 v36,77.36 | SDRAM.81 v36,90.36 | XIO.F17 33,48.87 33,47.87 v32,46.87 | XC7S25.G2 v89,38.37 | XC7S25.K2 v85,38.37 | XC7S25.N2 v82,38.37 | XC7S25.N6 v82,34.37 | XC7S25.N8 v82,31.36 | XC7S25.G13 v89,26.36 | XC7S25.K13 v85,26.36 | XC7S25.N13 v82,26.36 | XIO.B1 v37.1,62.07 | XIO.F5 v33.9,58.87 | XIO.G5 v33.1,58.87 | XIO.H5 v32.3,58.87 | XIO.K5 v29.9,58.87 | XIO.L5 v29.1,58.87 | XIO.M5 v28.3,58.87 | XIO.A6 v37.9,58.07 | XIO.E6 v34.7,58.07 | XIO.N7 v27.5,57.27 | XIO.N8 v27.5,56.47 | XIO.E9 v34.7,54.87 | XIO.N10 v27.5,54.07 | XIO.E11 v34.7,53.27 | XIO.N11 v27.5,53.27 | XIO.N12 v27.5,52.47 | XIO.U12 v24.3,52.47 | XIO.G13 v33.1,51.66 | XIO.H13 v32.3,51.66 | XIO.J13 v31.5,51.66 | XIO.K13 v29.9,51.66 | XIO.L13 v29.1,51.66 | XIO.M13 v28.3,51.66 | XIO.C17 v36.3,48.47 | XIO.P17 v26.7,48.47 | R115.2 63.66,26.96 v63.3,26.96 | 54.05,28.86 R84.1 R85.1
  other vias: 131.75,8.37 132.75,8.37 132.75,7.67 131.75,7.67 129.5,0.81 131.8,1.91 131.8,0.86 130.5,0.86 129.5,1.97 132.85,0.86 132.85,1.91 130.5,1.97 133.8,0.92 133.8,1.91 134.8,1.91 134.8,0.92 135.8,0.92 135.8,1.91 136.8,1.91 136.8,0.92 137.8,0.92 137.8,1.91 138.8,1.91 138.8,0.92 129.5,7.92 130.5,7.92 130.5,6.92 129.5,6.92 129.5,5.92 130.5,5.92 130.5,4.92 129.5,4.92 129.5,3.92 130.5,3.92 130.5,2.92 129.5,2.92
  pour Route15: -1.91,101.6 44.86,101.68 171.72,101.68 171.72,-1.91 -1.91,-1.91
  pour Top (no thermals): 129.85,11.02 133.25,11.02 133.25,3.32 133.8,2.76 142.91,2.76 142.91,0.28 142.7,0.06 129.25,0.06 129.25,10.42
+5V  (via drill 0.2, 0.2 pad 0.48, 0.35)
  Top 0.305: v122,8.37 122.2,8.57 123.55,8.57 123.75,8.37 FPGA_1_0.3 | C121.1 112.55,90.81 v113.5,89.86 | C122.1 90.4,91.86 90.9,92.36 98.06,92.36 SLOT2.B1 96.5,91.42 96.19,91.11 C55.1 | C113.1 44.22,13.77 | 44.22,13.77 44.22,13.59 44,13.37 v42,13.37 | D1.2 36.46,7.12 36.7,7.37 v37,7.37 | C71.1 v146,32.37 | C69.1 135.75,44.37 v137,44.37 | R129.1 120.5,13.17 v120.5,12.37 | D2.2 41.69,6.06 v42,6.37 | R119.1 24.67,32.04 v25,32.37 | R139.1 139.9,4.46 v140,4.37 | C72.1 v135.5,32.37 | C70.1 145.25,45.37 v146,45.37 | C117.1 136.05,54.62 135.81,54.87 v135.5,54.87 | R67.1 168.71,12.61 168.95,12.37 v169,12.37 | C173.1 25.47,30.9 v25.5,30.86 | C67.1 136.4,51.37 v137,51.37 | R50.1 39.21,10.16 v39,10.37 | C80.1 26.24,31.91 26,32.16 v26,32.37 | R51.1 35.77,10.63 v36,10.87 | R133.2 135.85,18.21 v136,18.36 | C116.1 136.8,30.56 v137,30.36 | C68.1 136.76,42 137,42.25 v137,42.37 | R77.1 167,13.15 v167,12.37 | C114.1 91.05,12.31 v91,12.37 | C87.1 34.05,24.31 v34,24.36 | C66.1 136.91,28.45 v137,28.36 | PSW.1 20.48,31.12 20.24,31.36 v20,31.36 | U$8.1 138.66,34.37 v138,34.37 | U$6.6 139.34,46.37 v140,46.37 | U$7.1 142.66,34.12 142.9,34.37 v143,34.37 | U$5.6 143.34,46.12 143.1,46.37 v143,46.37 | U$8.5 v140,33.37 | U$7.5 v144,33.37 | VREG_33.5 138.62,16.99 v139,17.36 | VREG_33.7 137.32,17.04 v137,17.36 | VREG_33.6 137.97,17.34 v138,17.36 | LVL_ALO.23 138.52,28.61 138.76,28.36 v139,28.36 | LVL_AHI.23 138.52,52.89 v138,52.37 | LVL_AHI.24 137.87,55.24 v138,55.37 | LVL_D.23 138.52,43.12 138.76,43.37 v139,43.37 | LVL_ALO.24 137.87,28.49 v138,28.36 | LVL_D.24 137.87,43.24 v138,43.37 | C119.1 129.7,91.56 135.86,91.56 SLOT4.B2 135.5,90.42 134.81,91.11 C81.1
  Top 0.305: C120.1 70.5,90.81 70.5,89.86 v68.5,89.86 | C118.1 56,94.36 57,93.36 SLOT0.B2 56,90.42 55.31,91.11 C53.1 | C54.1 74.83,91.09 75.5,90.42 SLOT1.B2 | C56.1 115.81,90.61 116,90.42 SLOT3.B2 | C115.1 109.95,12.31 v110,12.37 | C113.1 | C113.1 44.22,13.77
  other vias: 150.7,7.07 151.7,7.07 152.7,7.07 153.7,7.07 154.7,7.07 150.7,8.06 151.7,8.06 152.7,8.06 153.7,8.06 154.7,8.06 155.7,8.06 149.7,7.07 149.7,8.06 148.7,7.07 148.7,8.06 19.2,32.16 19.2,30.96 19.2,29.76 18,29.76 18,30.96 18,32.16 123.6,4.17 123.6,3.37 110.8,12.37 110.8,11.56 110.8,10.77 110.8,9.96 110.8,9.17 110.8,8.37 110.8,7.56 110.8,6.77 110.8,5.96 110,5.96 110,6.77 110,7.56 110,8.37 110,9.17 110,9.96 110,10.77 110,11.56
  pour Route14: 110.5,-5.13 172.5,-5.13 172.5,102.86 54.2,102.86 54.2,89.86 135,89.86 135,14.12 134.07,13.29 47.18,13.19 27.5,32.87 16,32.87 -4,32.87 -4,-4.13 -3,-5.13
  pour Top (no thermals): 144.75,18.71 147.9,18.71 155.5,11.12 157.25,11.12 157.55,10.81 157.55,7.17 157,6.62 148.5,6.62 148.25,6.87 148,7.12 148,8.62 148,8.87 147.75,9.12 146.8,10.06 144.75,10.06